# EAGLE design 28ChFNIRS (EAGLE 9.6.2)
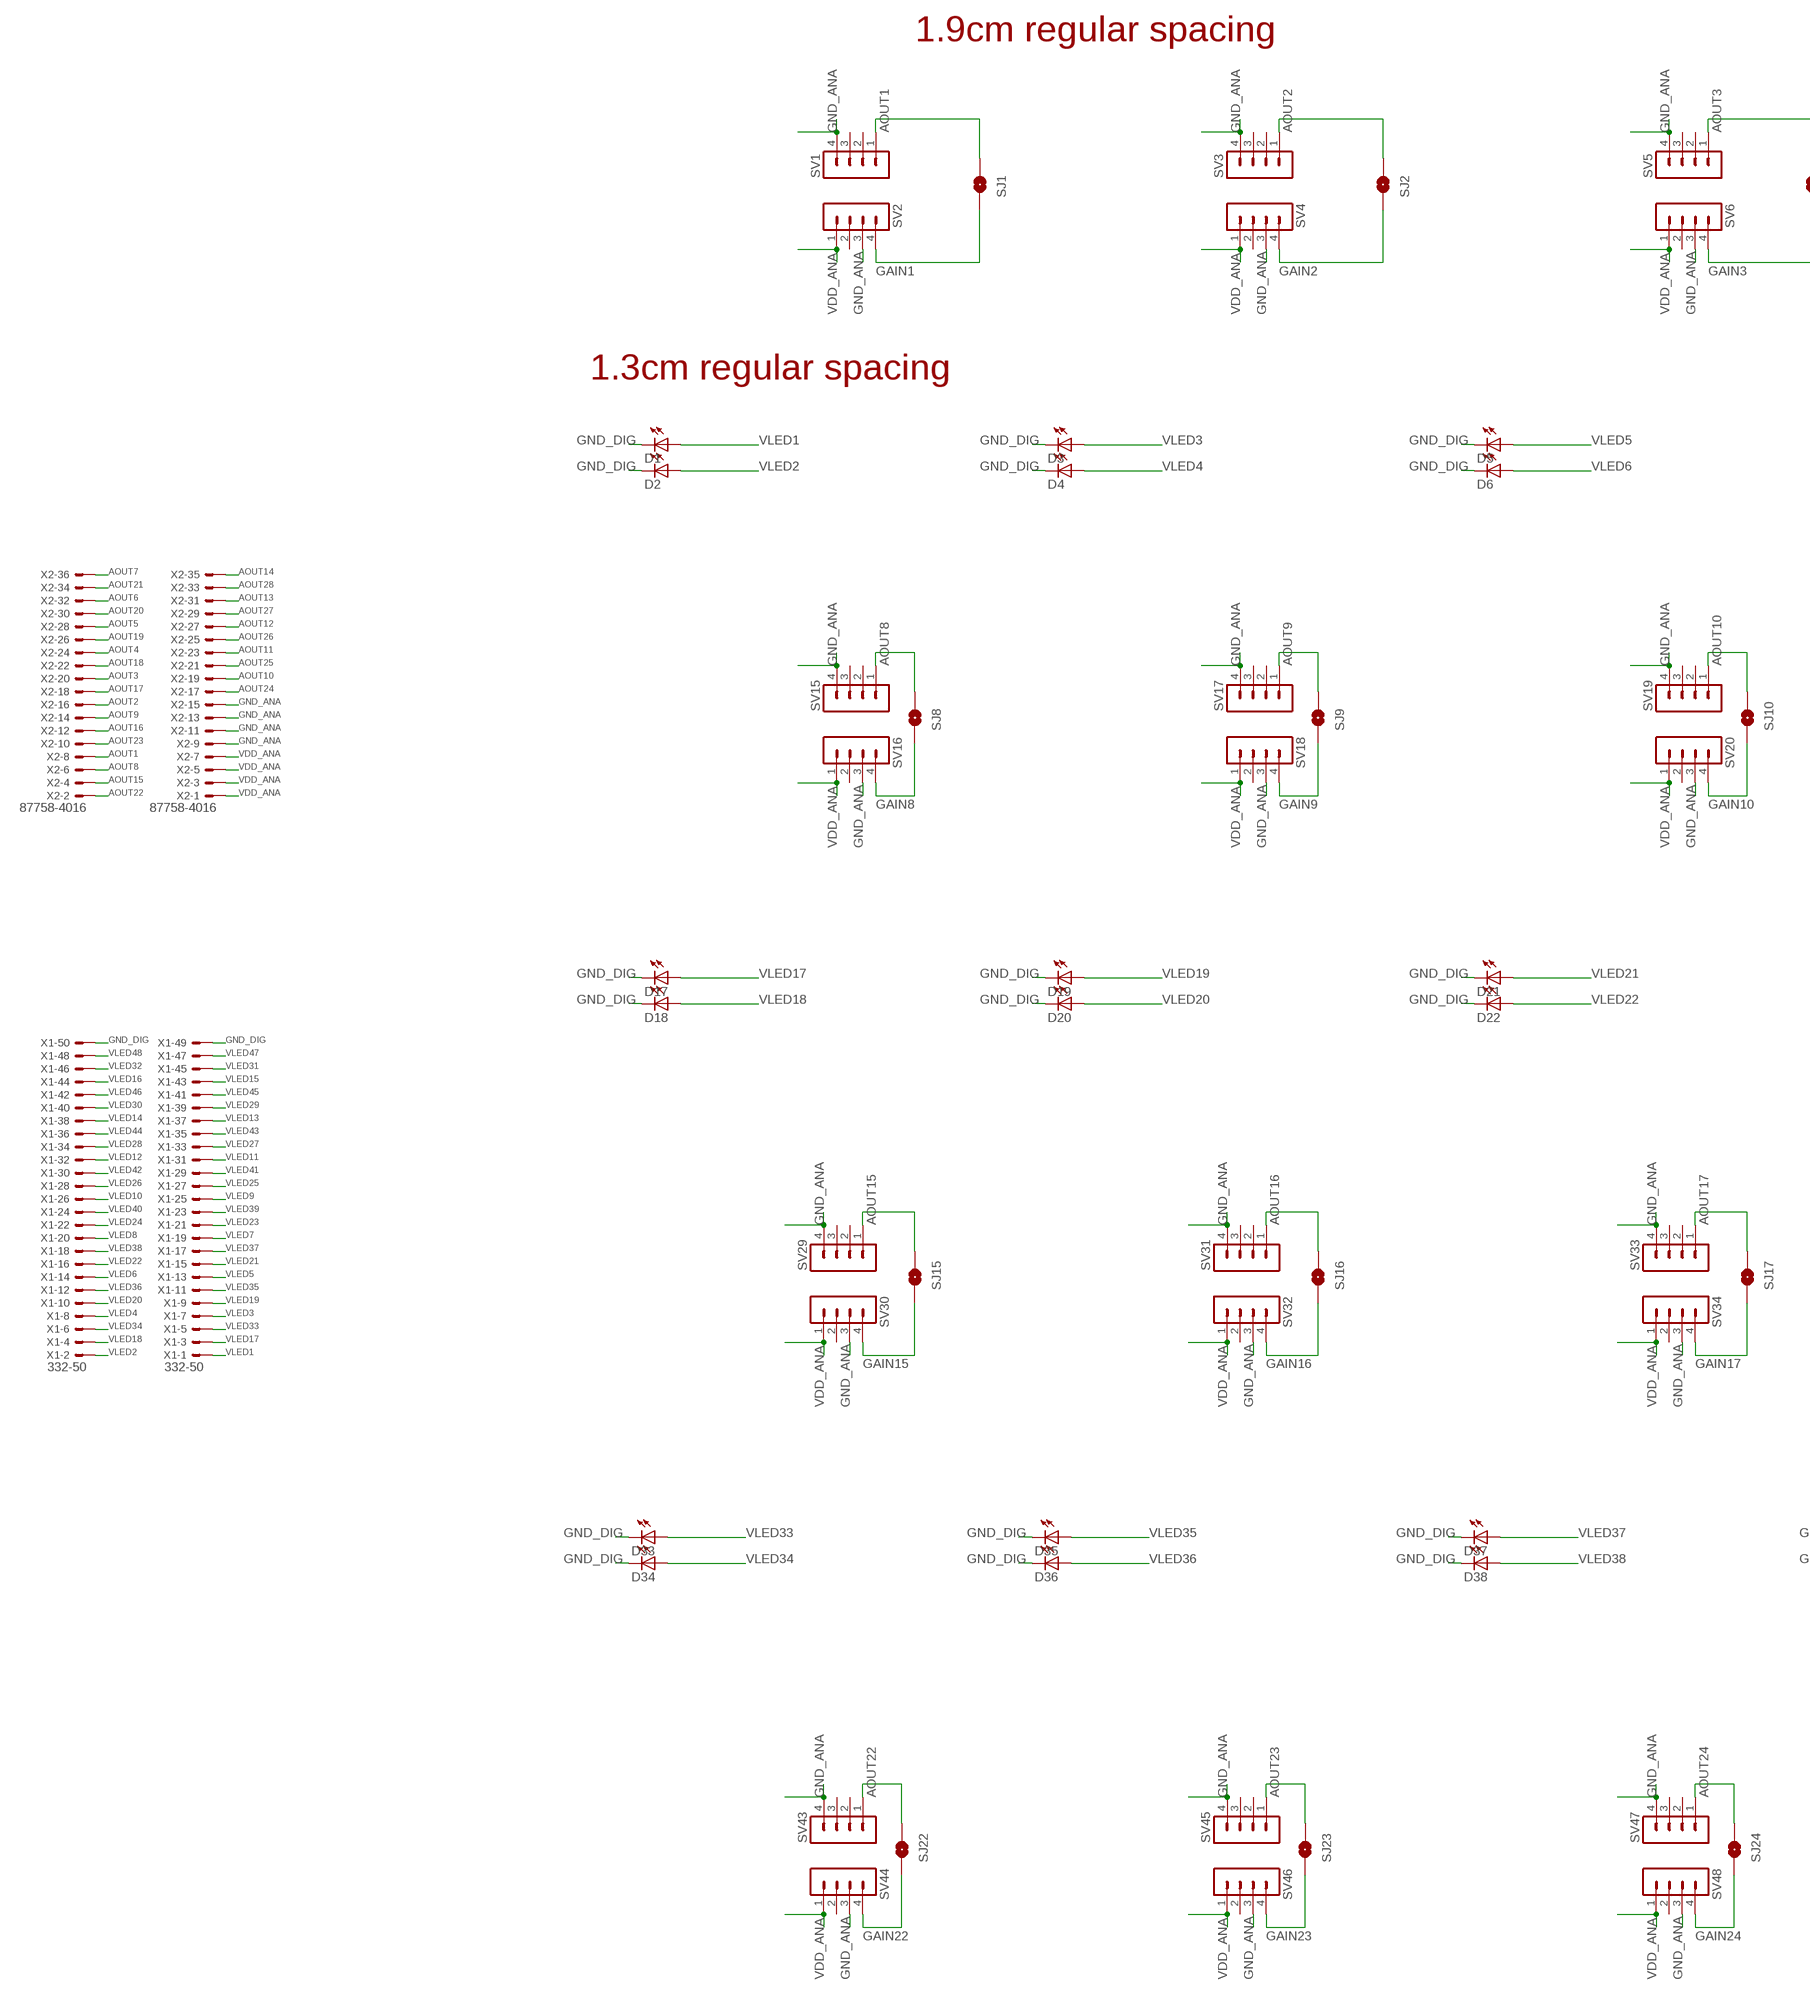
[diagram p0: schematic, sheet 1, part 1 of 2]
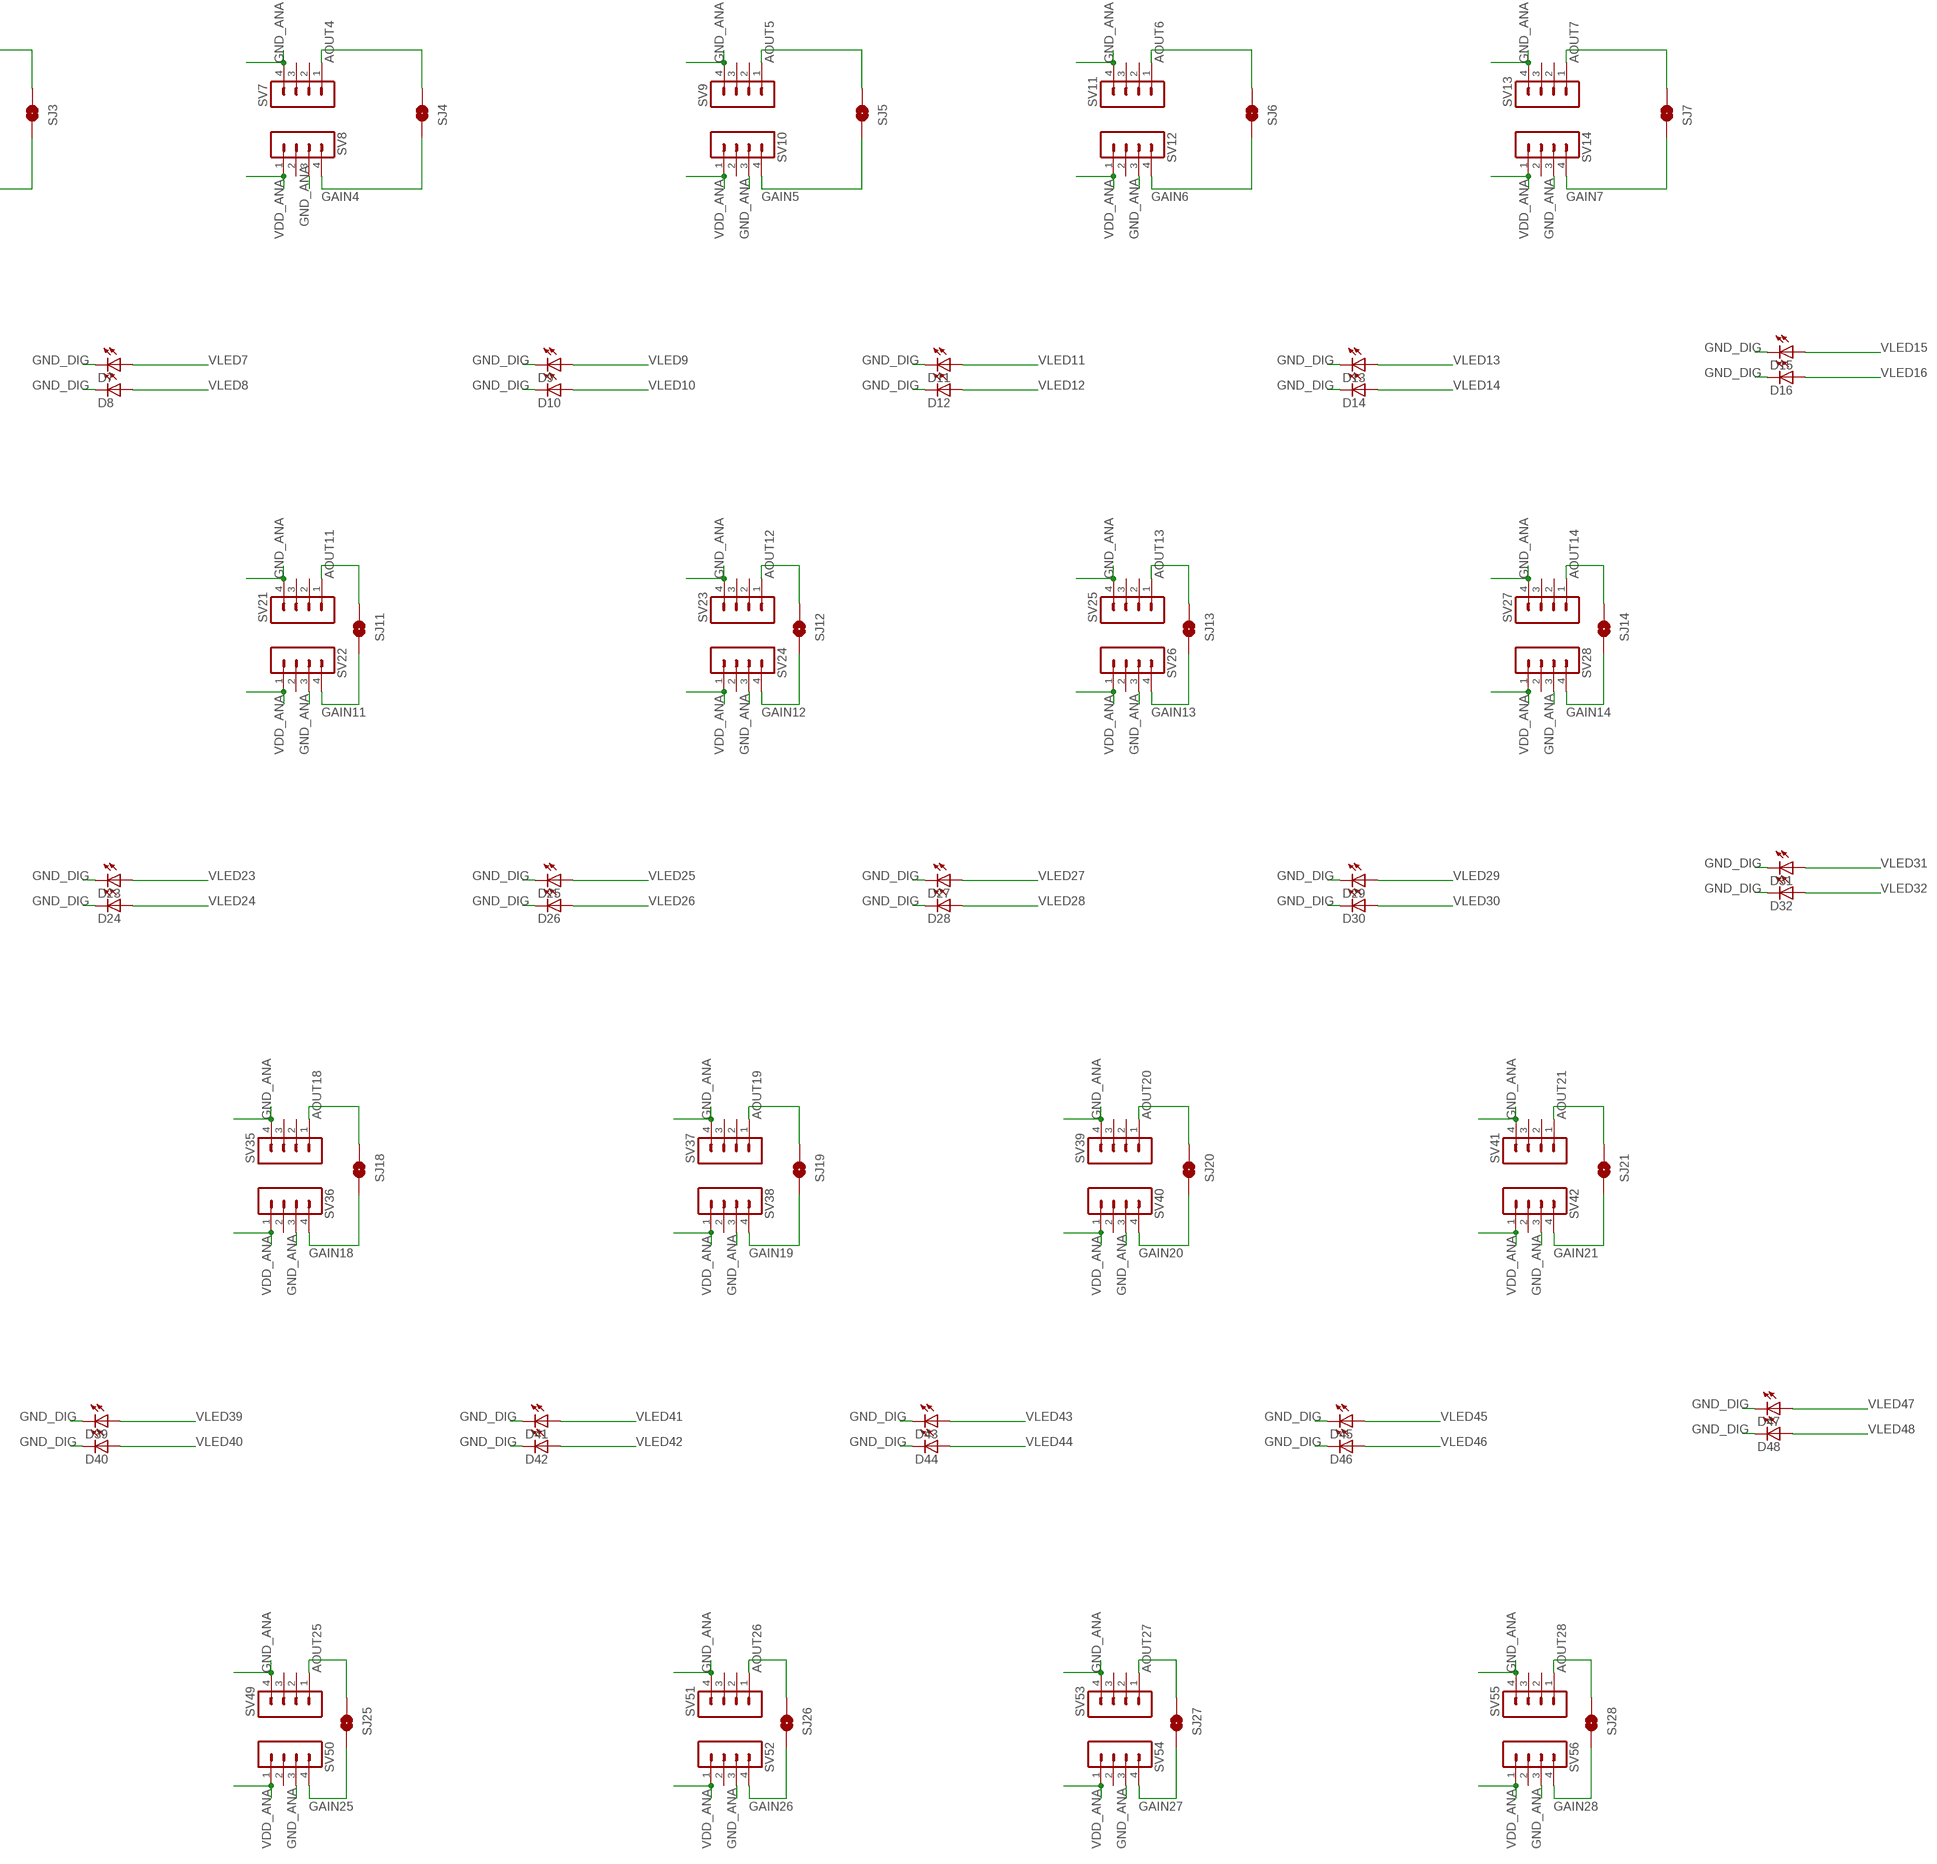
[diagram p1: schematic, sheet 1, part 2 of 2]

## Parts
D1  LED1206  [LED-1206]
D2  LED1206  [LED-1206]
D3  LED1206  [LED-1206]
D4  LED1206  [LED-1206]
D5  LED1206  [LED-1206]
D6  LED1206  [LED-1206]
D7  LED1206  [LED-1206]
D8  LED1206  [LED-1206]
D9  LED1206  [LED-1206]
D10  LED1206  [LED-1206]
D11  LED1206  [LED-1206]
D12  LED1206  [LED-1206]
D13  LED1206  [LED-1206]
D14  LED1206  [LED-1206]
D15  LED1206  [LED-1206]
D16  LED1206  [LED-1206]
D17  LED1206  [LED-1206]
D18  LED1206  [LED-1206]
D19  LED1206  [LED-1206]
D20  LED1206  [LED-1206]
D21  LED1206  [LED-1206]
D22  LED1206  [LED-1206]
D23  LED1206  [LED-1206]
D24  LED1206  [LED-1206]
D25  LED1206  [LED-1206]
D26  LED1206  [LED-1206]
D27  LED1206  [LED-1206]
D28  LED1206  [LED-1206]
D29  LED1206  [LED-1206]
D30  LED1206  [LED-1206]
D31  LED1206  [LED-1206]
D32  LED1206  [LED-1206]
D33  LED1206  [LED-1206]
D34  LED1206  [LED-1206]
D35  LED1206  [LED-1206]
D36  LED1206  [LED-1206]
D37  LED1206  [LED-1206]
D38  LED1206  [LED-1206]
D39  LED1206  [LED-1206]
D40  LED1206  [LED-1206]
D41  LED1206  [LED-1206]
D42  LED1206  [LED-1206]
D43  LED1206  [LED-1206]
D44  LED1206  [LED-1206]
D45  LED1206  [LED-1206]
D46  LED1206  [LED-1206]
D47  LED1206  [LED-1206]
D48  LED1206  [LED-1206]
SJ1  SOLDERJUMPERNC  [SJ_2S_SMALL]
SJ2  SOLDERJUMPERNC  [SJ_2S_SMALL]
SJ3  SOLDERJUMPERNC  [SJ_2S_SMALL]
SJ4  SOLDERJUMPERNC  [SJ_2S_SMALL]
SJ5  SOLDERJUMPERNC  [SJ_2S_SMALL]
SJ6  SOLDERJUMPERNC  [SJ_2S_SMALL]
SJ7  SOLDERJUMPERNC  [SJ_2S_SMALL]
SJ8  SOLDERJUMPERNC  [SJ_2S_SMALL]
SJ9  SOLDERJUMPERNC  [SJ_2S_SMALL]
SJ10  SOLDERJUMPERNC  [SJ_2S_SMALL]
SJ11  SOLDERJUMPERNC  [SJ_2S_SMALL]
SJ12  SOLDERJUMPERNC  [SJ_2S_SMALL]
SJ13  SOLDERJUMPERNC  [SJ_2S_SMALL]
SJ14  SOLDERJUMPERNC  [SJ_2S_SMALL]
SJ15  SOLDERJUMPERNC  [SJ_2S_SMALL]
SJ16  SOLDERJUMPERNC  [SJ_2S_SMALL]
SJ17  SOLDERJUMPERNC  [SJ_2S_SMALL]
SJ18  SOLDERJUMPERNC  [SJ_2S_SMALL]
SJ19  SOLDERJUMPERNC  [SJ_2S_SMALL]
SJ20  SOLDERJUMPERNC  [SJ_2S_SMALL]
SJ21  SOLDERJUMPERNC  [SJ_2S_SMALL]
SJ22  SOLDERJUMPERNC  [SJ_2S_SMALL]
SJ23  SOLDERJUMPERNC  [SJ_2S_SMALL]
SJ24  SOLDERJUMPERNC  [SJ_2S_SMALL]
SJ25  SOLDERJUMPERNC  [SJ_2S_SMALL]
SJ26  SOLDERJUMPERNC  [SJ_2S_SMALL]
SJ27  SOLDERJUMPERNC  [SJ_2S_SMALL]
SJ28  SOLDERJUMPERNC  [SJ_2S_SMALL]
SV1  MA04-1  [MA04-1]
SV2  MA04-1  [MA04-1]
SV3  MA04-1  [MA04-1]
SV4  MA04-1  [MA04-1]
SV5  MA04-1  [MA04-1]
SV6  MA04-1  [MA04-1]
SV7  MA04-1  [MA04-1]
SV8  MA04-1  [MA04-1]
SV9  MA04-1  [MA04-1]
SV10  MA04-1  [MA04-1]
SV11  MA04-1  [MA04-1]
SV12  MA04-1  [MA04-1]
SV13  MA04-1  [MA04-1]
SV14  MA04-1  [MA04-1]
SV15  MA04-1  [MA04-1]
SV16  MA04-1  [MA04-1]
SV17  MA04-1  [MA04-1]
SV18  MA04-1  [MA04-1]
SV19  MA04-1  [MA04-1]
SV20  MA04-1  [MA04-1]
SV21  MA04-1  [MA04-1]
SV22  MA04-1  [MA04-1]
SV23  MA04-1  [MA04-1]
SV24  MA04-1  [MA04-1]
SV25  MA04-1  [MA04-1]
SV26  MA04-1  [MA04-1]
SV27  MA04-1  [MA04-1]
SV28  MA04-1  [MA04-1]
SV29  MA04-1  [MA04-1]
SV30  MA04-1  [MA04-1]
SV31  MA04-1  [MA04-1]
SV32  MA04-1  [MA04-1]
SV33  MA04-1  [MA04-1]
SV34  MA04-1  [MA04-1]
SV35  MA04-1  [MA04-1]
SV36  MA04-1  [MA04-1]
SV37  MA04-1  [MA04-1]
SV38  MA04-1  [MA04-1]
SV39  MA04-1  [MA04-1]
SV40  MA04-1  [MA04-1]
SV41  MA04-1  [MA04-1]
SV42  MA04-1  [MA04-1]
SV43  MA04-1  [MA04-1]
SV44  MA04-1  [MA04-1]
SV45  MA04-1  [MA04-1]
SV46  MA04-1  [MA04-1]
SV47  MA04-1  [MA04-1]
SV48  MA04-1  [MA04-1]
SV49  MA04-1  [MA04-1]
SV50  MA04-1  [MA04-1]
SV51  MA04-1  [MA04-1]
SV52  MA04-1  [MA04-1]
SV53  MA04-1  [MA04-1]
SV54  MA04-1  [MA04-1]
SV55  MA04-1  [MA04-1]
SV56  MA04-1  [MA04-1]
X1  332-50  [332-50]
X2  87758-4016  [87758-4016]

## Nets
AOUT1: SJ1.2 SV1.1 X2.8
AOUT2: SJ2.2 SV3.1 X2.16
AOUT3: SJ3.2 SV5.1 X2.20
AOUT4: SJ4.2 SV7.1 X2.24
AOUT5: SJ5.2 SV9.1 X2.28
AOUT6: SJ6.2 SV11.1 X2.32
AOUT7: SJ7.2 SV13.1 X2.36
AOUT8: SJ8.2 SV15.1 X2.6
AOUT9: SJ9.2 SV17.1 X2.14
AOUT10: SJ10.2 SV19.1 X2.19
AOUT11: SJ11.2 SV21.1 X2.23
AOUT12: SJ12.2 SV23.1 X2.27
AOUT13: SJ13.2 SV25.1 X2.31
AOUT14: SJ14.2 SV27.1 X2.35
AOUT15: SJ15.2 SV29.1 X2.4
AOUT16: SJ16.2 SV31.1 X2.12
AOUT17: SJ17.2 SV33.1 X2.18
AOUT18: SJ18.2 SV35.1 X2.22
AOUT19: SJ19.2 SV37.1 X2.26
AOUT20: SJ20.2 SV39.1 X2.30
AOUT21: SJ21.2 SV41.1 X2.34
AOUT22: SJ22.2 SV43.1 X2.2
AOUT23: SJ23.2 SV45.1 X2.10
AOUT24: SJ24.2 SV47.1 X2.17
AOUT25: SJ25.2 SV49.1 X2.21
AOUT26: SJ26.2 SV51.1 X2.25
AOUT27: SJ27.2 SV53.1 X2.29
AOUT28: SJ28.2 SV55.1 X2.33
GAIN1: SJ1.1 SV2.4
GAIN2: SJ2.1 SV4.4
GAIN3: SJ3.1 SV6.4
GAIN4: SJ4.1 SV8.4
GAIN5: SJ5.1 SV10.4
GAIN6: SJ6.1 SV12.4
GAIN7: SJ7.1 SV14.4
GAIN8: SJ8.1 SV16.4
GAIN9: SJ9.1 SV18.4
GAIN10: SJ10.1 SV20.4
GAIN11: SJ11.1 SV22.4
GAIN12: SJ12.1 SV24.4
GAIN13: SJ13.1 SV26.4
GAIN14: SJ14.1 SV28.4
GAIN15: SJ15.1 SV30.4
GAIN16: SJ16.1 SV32.4
GAIN17: SJ17.1 SV34.4
GAIN18: SJ18.1 SV36.4
GAIN19: SJ19.1 SV38.4
GAIN20: SJ20.1 SV40.4
GAIN21: SJ21.1 SV42.4
GAIN22: SJ22.1 SV44.4
GAIN23: SJ23.1 SV46.4
GAIN24: SJ24.1 SV48.4
GAIN25: SJ25.1 SV50.4
GAIN26: SJ26.1 SV52.4
GAIN27: SJ27.1 SV54.4
GAIN28: SJ28.1 SV56.4
GND_ANA: SV1.4 SV2.3 SV3.4 SV4.3 SV5.4 SV6.3 SV7.4 SV8.3 SV9.4 SV10.3 SV11.4 SV12.3 SV13.4 SV14.3 SV15.4 SV16.3 SV17.4 SV18.3 SV19.4 SV20.3 SV21.4 SV22.3 SV23.4 SV24.3 SV25.4 SV26.3 SV27.4 SV28.3 SV29.4 SV30.3 SV31.4 SV32.3 SV33.4 SV34.3 SV35.4 SV36.3 SV37.4 SV38.3 SV39.4 SV40.3 SV41.4 SV42.3 SV43.4 SV44.3 SV45.4 SV46.3 SV47.4 SV48.3 SV49.4 SV50.3 SV51.4 SV52.3 SV53.4 SV54.3 SV55.4 SV56.3 X2.9 X2.11 X2.13 X2.15
GND_DIG: D1.C D2.C D3.C D4.C D5.C D6.C D7.C D8.C D9.C D10.C D11.C D12.C D13.C D14.C D15.C D16.C D17.C D18.C D19.C D20.C D21.C D22.C D23.C D24.C D25.C D26.C D27.C D28.C D29.C D30.C D31.C D32.C D33.C D34.C D35.C D36.C D37.C D38.C D39.C D40.C D41.C D42.C D43.C D44.C D45.C D46.C D47.C D48.C X1.49 X1.50
VDD_ANA: SV2.1 SV4.1 SV6.1 SV8.1 SV10.1 SV12.1 SV14.1 SV16.1 SV18.1 SV20.1 SV22.1 SV24.1 SV26.1 SV28.1 SV30.1 SV32.1 SV34.1 SV36.1 SV38.1 SV40.1 SV42.1 SV44.1 SV46.1 SV48.1 SV50.1 SV52.1 SV54.1 SV56.1 X2.1 X2.3 X2.5 X2.7
VLED1: D1.A X1.1
VLED2: D2.A X1.2
VLED3: D3.A X1.7
VLED4: D4.A X1.8
VLED5: D5.A X1.13
VLED6: D6.A X1.14
VLED7: D7.A X1.19
VLED8: D8.A X1.20
VLED9: D9.A X1.25
VLED10: D10.A X1.26
VLED11: D11.A X1.31
VLED12: D12.A X1.32
VLED13: D13.A X1.37
VLED14: D14.A X1.38
VLED15: D15.A X1.43
VLED16: D16.A X1.44
VLED17: D17.A X1.3
VLED18: D18.A X1.4
VLED19: D19.A X1.9
VLED20: D20.A X1.10
VLED21: D21.A X1.15
VLED22: D22.A X1.16
VLED23: D23.A X1.21
VLED24: D24.A X1.22
VLED25: D25.A X1.27
VLED26: D26.A X1.28
VLED27: D27.A X1.33
VLED28: D28.A X1.34
VLED29: D29.A X1.39
VLED30: D30.A X1.40
VLED31: D31.A X1.45
VLED32: D32.A X1.46
VLED33: D33.A X1.5
VLED34: D34.A X1.6
VLED35: D35.A X1.11
VLED36: D36.A X1.12
VLED37: D37.A X1.17
VLED38: D38.A X1.18
VLED39: D39.A X1.23
VLED40: D40.A X1.24
VLED41: D41.A X1.29
VLED42: D42.A X1.30
VLED43: D43.A X1.35
VLED44: D44.A X1.36
VLED45: D45.A X1.41
VLED46: D46.A X1.42
VLED47: D47.A X1.47
VLED48: D48.A X1.48
Unconnected: SV1.2 SV1.3 SV2.2 SV3.2 SV3.3 SV4.2 SV5.2 SV5.3 SV6.2 SV7.2 SV7.3 SV8.2 SV9.2 SV9.3 SV10.2 SV11.2 SV11.3 SV12.2 SV13.2 SV13.3 SV14.2 SV15.2 SV15.3 SV16.2 SV17.2 SV17.3 SV18.2 SV19.2 SV19.3 SV20.2 SV21.2 SV21.3 SV22.2 SV23.2 SV23.3 SV24.2 SV25.2 SV25.3 SV26.2 SV27.2 SV27.3 SV28.2 SV29.2 SV29.3 SV30.2 SV31.2 SV31.3 SV32.2 SV33.2 SV33.3 SV34.2 SV35.2 SV35.3 SV36.2 SV37.2 SV37.3 SV38.2 SV39.2 SV39.3 SV40.2 SV41.2 SV41.3 SV42.2 SV43.2 SV43.3 SV44.2 SV45.2 SV45.3 SV46.2 SV47.2 SV47.3 SV48.2 SV49.2 SV49.3 SV50.2 SV51.2 SV51.3 SV52.2 SV53.2 SV53.3 SV54.2 SV55.2 SV55.3 SV56.2 X2.37 X2.38 X2.39 X2.40

## Notes on the sheet
- 1.9cm regular spacing
- 1.3cm regular spacing

## Library data of the parts
D1-D48 = epic:LED: LEDs Standard schematic elements and footprints for 5mm, 3mm, 1206, and 0603 sized LEDs. 5mm - Spark Fun Electronics SKU : COM-00529 (and others)
SJ1-SJ28 = headers:SOLDERJUMPER: Solder Jumper Standard SMD solder jumper. Used to automate production. Two varients : Normally Open and Normally Closed are the same, but have different paste layers. NC will have a large amount of paste and should jumper during reflow.
SV1-SV56 = con-lstb:MA04-1: PIN HEADER; OC_FARNELL: unknown; OC_NEWARK: unknown
X1 = con-garry:332-50: 50 Pin - 2mm Dual Row Source: www.mpe-connector.de / garry_shortform_2012.pdf
X2 = con-molex:87758-4016: 40 Pin - 2mm Dual Row Single Wafer, Vertical T/H HDR Source: http://www.molex.com/pdm_docs/sd/877580616_sd.pdf; MF: MOLEX; MPN: 87758-4016; OC_FARNELL: unknown; OC_NEWARK: 25M5691

## Board
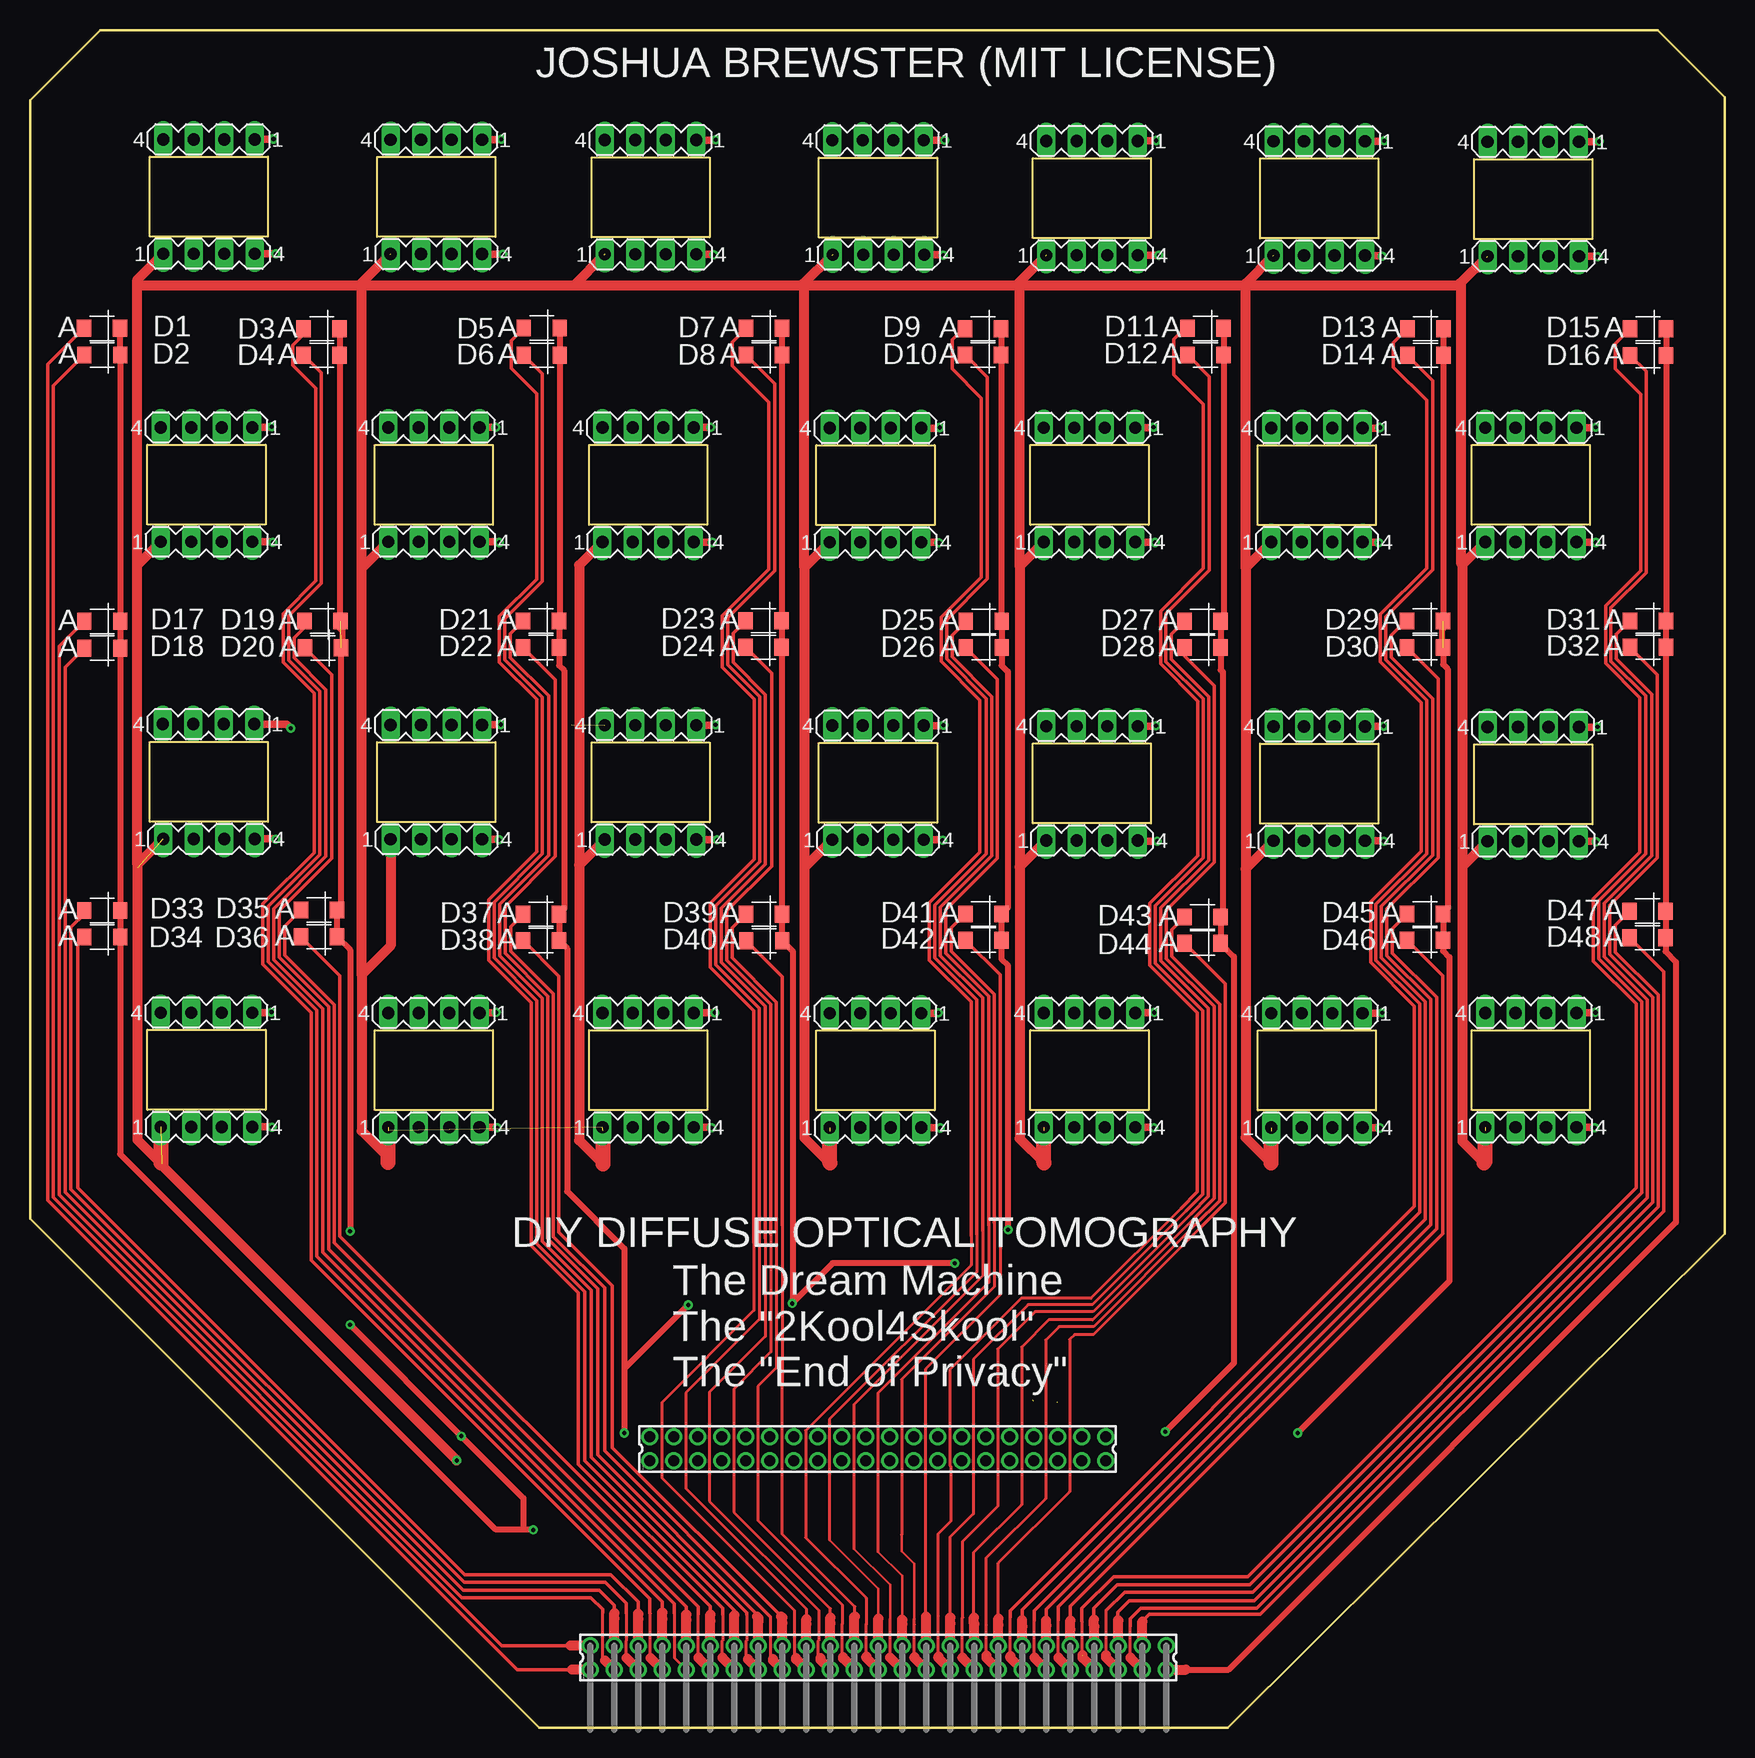
[diagram p2: board, top side]
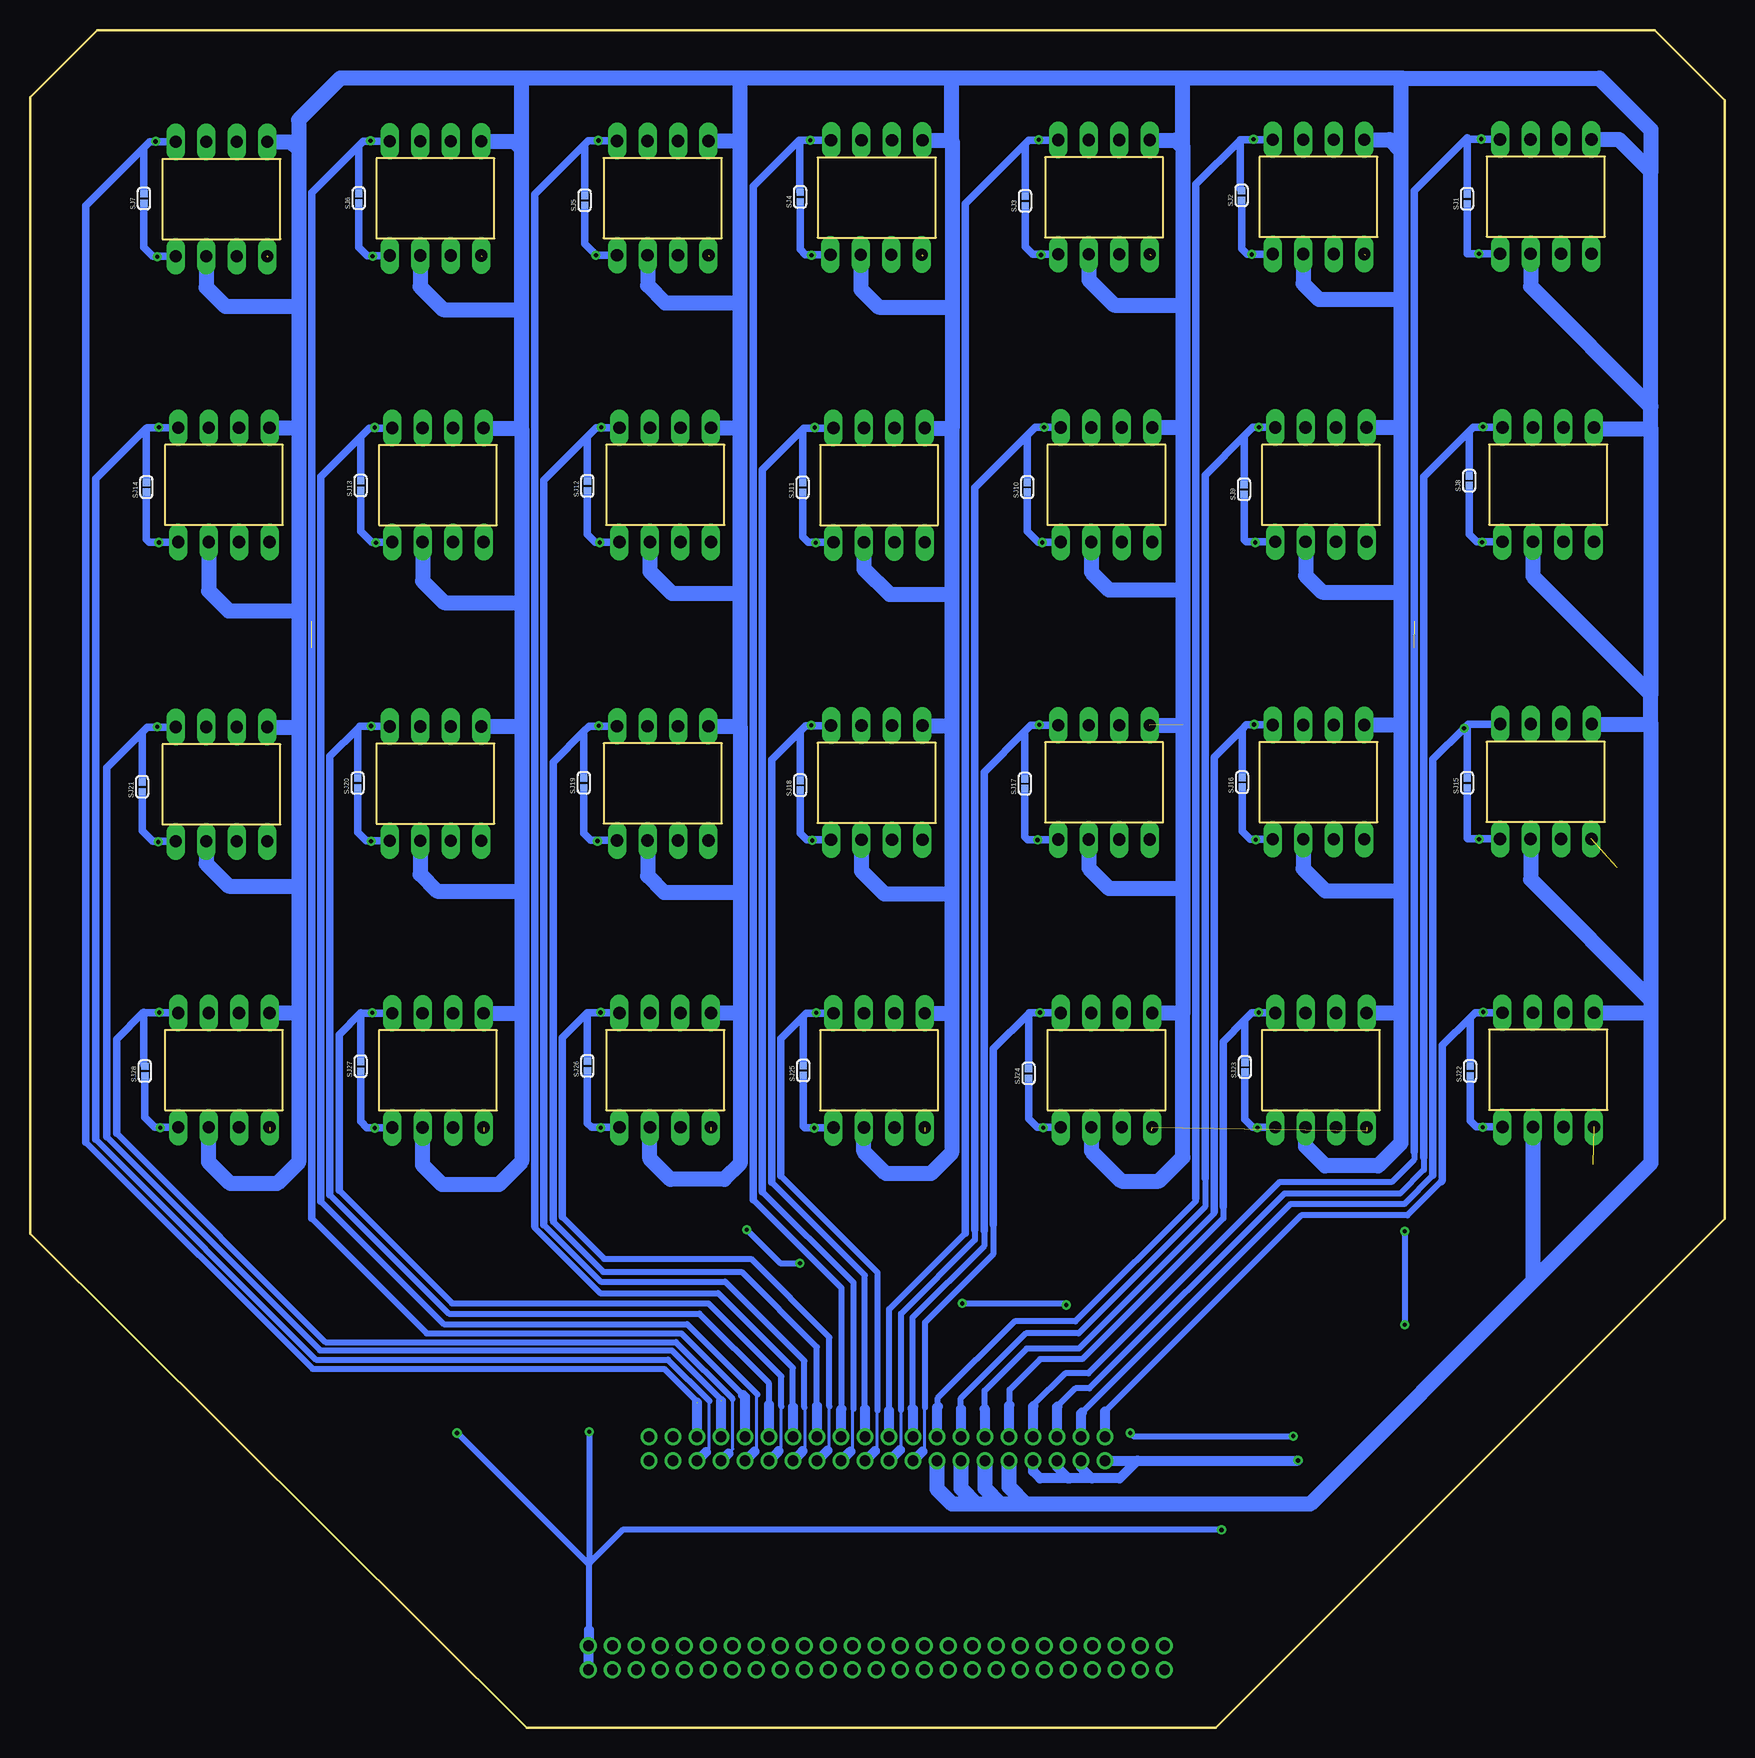
[diagram p3: board, bottom side, seen from below]

Size 141.22 x 141.48 mm. Coordinates in mm from the lower left corner, seen from the top.
Outline: 38.78,124.23 28.94,124.23 28.94,130.9 38.78,130.9 38.78,124.23
Outline: 19.83,124.26 9.99,124.26 9.99,130.92 19.83,130.92 19.83,124.26
Outline: 75.58,124.18 65.74,124.18 65.74,130.85 75.58,130.85 75.58,124.18
Outline: 56.64,124.21 46.79,124.21 46.79,130.87 56.64,130.87 56.64,124.21
Outline: 112.36,124.1 102.52,124.1 102.52,130.77 112.36,130.77 112.36,124.1
Outline: 93.41,124.13 83.57,124.13 83.57,130.8 93.41,130.8 93.41,124.13
Outline: 130.19,124.05 120.35,124.05 120.35,130.72 130.19,130.72 130.19,124.05
Outline: 9.79,106.93 19.63,106.93 19.63,100.27 9.79,100.27 9.79,106.93
Outline: 28.73,106.91 38.58,106.91 38.58,100.24 28.73,100.24 28.73,106.91
Outline: 46.59,106.91 56.43,106.91 56.43,100.24 46.59,100.24 46.59,106.91
Outline: 65.54,106.88 75.38,106.88 75.38,100.22 65.54,100.22 65.54,106.88
Outline: 83.37,106.91 93.21,106.91 93.21,100.24 83.37,100.24 83.37,106.91
Outline: 102.32,106.88 112.16,106.88 112.16,100.22 102.32,100.22 102.32,106.88
Outline: 120.15,106.91 129.99,106.91 129.99,100.24 120.15,100.24 120.15,106.91
Outline: 38.78,75.46 28.94,75.46 28.94,82.13 38.78,82.13 38.78,75.46
Outline: 19.83,75.49 9.99,75.49 9.99,82.16 19.83,82.16 19.83,75.49
Outline: 75.58,75.41 65.74,75.41 65.74,82.08 75.58,82.08 75.58,75.41
Outline: 56.64,75.44 46.79,75.44 46.79,82.11 56.64,82.11 56.64,75.44
Outline: 112.36,75.34 102.52,75.34 102.52,82 112.36,82 112.36,75.34
Outline: 93.41,75.36 83.57,75.36 83.57,82.03 93.41,82.03 93.41,75.36
Outline: 130.19,75.29 120.35,75.29 120.35,81.95 130.19,81.95 130.19,75.29
Outline: 9.79,58.17 19.63,58.17 19.63,51.5 9.79,51.5 9.79,58.17
Outline: 28.73,58.14 38.58,58.14 38.58,51.47 28.73,51.47 28.73,58.14
Outline: 46.59,58.14 56.43,58.14 56.43,51.47 46.59,51.47 46.59,58.14
Outline: 65.54,58.11 75.38,58.11 75.38,51.45 65.54,51.45 65.54,58.11
Outline: 83.37,58.14 93.21,58.14 93.21,51.47 83.37,51.47 83.37,58.14
Outline: 102.32,58.11 112.16,58.11 112.16,51.45 102.32,51.45 102.32,58.11
Outline: 120.15,58.14 129.99,58.14 129.99,51.47 120.15,51.47 120.15,58.14
Outline: 42.42,0 0,42.42 0,135.64 5.84,141.48 135.64,141.48 141.22,135.89 141.22,41.15 99.82,0 42.42,0
Copper layers (1*16): Top 0.035mm / dielectric 1.5mm / Bottom 0.035mm
Design rules "default": minimum track width 6mil, minimum drill 0.35mm, track to track 6mil, track to pad 6mil, pad to pad 6mil, via to via 6mil, smd to smd 6mil, copper to edge 40mil, drill to drill 6mil, minimum pad ring 10mil, minimum via ring 8mil, stop-mask expansion 4mil, vias tented up to drill 0mil, thermal gap 10mil

### Footprints (pad centres in the part's own frame; a part is rotated, then mirrored left to right if it is on the bottom)
LED-1206 = smd 1.2 x 1.4: A -1.5,0; C 1.5,0
SJ_2S_SMALL = smd 0.6 x 0.6: 1 -0.4,0; 2 0.4,0
MA04-1 = drill 1.016 long: 1 -3.81,0; 2 -1.27,0; 3 1.27,0; 4 3.81,0
332-50 = drill 0.9 pad 1.27: 1 -24,-1; 2 -24,1; 3 -22,-1; 4 -22,1; 5 -20,-1; 6 -20,1; 7 -18,-1; 8 -18,1; 9 -16,-1; 10 -16,1; 11 -14,-1; 12 -14,1; 13 -12,-1; 14 -12,1; 15 -10,-1; 16 -10,1; 17 -8,-1; 18 -8,1; 19 -6,-1; 20 -6,1; 21 -4,-1; 22 -4,1; 23 -2,-1; 24 -2,1; 25 0,-1; 26 0,1; 27 2,-1; 28 2,1; 29 4,-1; 30 4,1; 31 6,-1; 32 6,1; 33 8,-1; 34 8,1; 35 10,-1; 36 10,1; 37 12,-1; 38 12,1; 39 14,-1; 40 14,1; 41 16,-1; 42 16,1; 43 18,-1; 44 18,1; 45 20,-1; 46 20,1; 47 22,-1; 48 22,1; 49 24,-1; 50 24,1
87758-4016 = drill 0.9 pad 1.27: 1 -19,-1; 2 -19,1; 3 -17,-1; 4 -17,1; 5 -15,-1; 6 -15,1; 7 -13,-1; 8 -13,1; 9 -11,-1; 10 -11,1; 11 -9,-1; 12 -9,1; 13 -7,-1; 14 -7,1; 15 -5,-1; 16 -5,1; 17 -3,-1; 18 -3,1; 19 -1,-1; 20 -1,1; 21 1,-1; 22 1,1; 23 3,-1; 24 3,1; 25 5,-1; 26 5,1; 27 7,-1; 28 7,1; 29 9,-1; 30 9,1; 31 11,-1; 32 11,1; 33 13,-1; 34 13,1; 35 15,-1; 36 15,1; 37 17,-1; 38 17,1; 39 19,-1; 40 19,1

### Placement (x,y rotation side)
D1  5.99,116.61 0 top
D2  6.02,114.4 0 top
D3  24.31,116.59 0 top
D4  24.31,114.38 0 top
D5  42.65,116.64 0 top
D6  42.65,114.38 0 top
D7  61.16,116.61 0 top
D8  61.16,114.4 0 top
D9  79.43,116.59 0 top
D10  79.43,114.4 0 top
D11  97.97,116.61 0 top
D12  97.97,114.4 0 top
D13  116.28,116.59 0 top
D14  116.28,114.38 0 top
D15  134.85,116.59 0 top
D16  134.85,114.35 0 top
D17  6.02,92.2 0 top
D18  6.02,89.97 0 top
D19  24.36,92.23 0 top
D20  24.41,89.99 0 top
D21  42.6,92.23 0 top
D22  42.6,90.02 0 top
D23  61.14,92.25 0 top
D24  61.14,90.04 0 top
D25  79.48,92.2 0 top
D26  79.48,90.02 0 top
D27  97.71,92.2 0 top
D28  97.71,90.02 0 top
D29  116.26,92.23 0 top
D30  116.26,90.02 0 top
D31  134.82,92.23 0 top
D32  134.82,90.04 0 top
D33  6.02,68.1 0 top
D34  6.02,65.89 0 top
D35  24.08,68.15 0 top
D36  24.08,65.91 0 top
D37  42.6,67.79 0 top
D38  42.6,65.61 0 top
D39  61.16,67.79 0 top
D40  61.19,65.58 0 top
D41  79.45,67.82 0 top
D42  79.45,65.63 0 top
D43  97.71,67.56 0 top
D44  97.71,65.38 0 top
D45  116.26,67.82 0 top
D46  116.26,65.63 0 top
D47  134.8,68.05 0 top
D48  134.8,65.84 0 top
SJ1  21.46,127.41 90 bottom
SJ2  40.26,127.69 90 bottom
SJ3  58.29,127.23 90 bottom
SJ4  77.04,127.56 90 bottom
SJ5  95,127.28 90 bottom
SJ6  113.82,127.46 90 bottom
SJ7  131.72,127.43 90 bottom
SJ8  21.29,103.91 90 bottom
SJ9  40.06,103.2 90 bottom
SJ10  58.12,103.38 90 bottom
SJ11  76.83,103.35 90 bottom
SJ12  94.77,103.48 90 bottom
SJ13  113.66,103.5 90 bottom
SJ14  131.52,103.38 90 bottom
SJ15  21.46,78.74 90 bottom
SJ16  40.21,78.79 90 bottom
SJ17  58.32,78.66 90 bottom
SJ18  77.04,78.54 90 bottom
SJ19  95.07,78.74 90 bottom
SJ20  113.92,78.71 90 bottom
SJ21  131.88,78.41 90 bottom
SJ22  21.21,54.71 90 bottom
SJ23  39.98,55.04 90 bottom
SJ24  58.01,54.53 90 bottom
SJ25  76.78,54.76 90 bottom
SJ26  94.77,55.14 90 bottom
SJ27  113.66,55.12 90 bottom
SJ28  131.65,54.71 90 bottom
SV1  14.91,132.36 180 top
SV2  14.91,122.83 0 top
SV3  33.86,132.33 180 top
SV4  33.86,122.81 0 top
SV5  51.71,132.31 180 top
SV6  51.71,122.78 0 top
SV7  70.66,132.28 180 top
SV8  70.71,122.76 0 top
SV9  88.49,132.23 180 top
SV10  88.49,122.71 0 top
SV11  107.44,132.21 180 top
SV12  107.44,122.68 0 top
SV13  125.27,132.16 180 top
SV14  125.27,122.63 0 top
SV15  14.71,108.36 180 top
SV16  14.71,98.83 0 top
SV17  33.66,108.36 180 top
SV18  33.66,98.83 0 top
SV19  51.51,108.36 180 top
SV20  51.51,98.81 0 top
SV21  70.46,108.31 180 top
SV22  70.46,98.78 0 top
SV23  88.29,108.33 180 top
SV24  88.29,98.81 0 top
SV25  107.24,108.31 180 top
SV26  107.24,98.81 0 top
SV27  125.07,108.33 180 top
SV28  125.07,98.81 0 top
SV29  14.88,83.64 180 top
SV30  14.91,74.07 0 top
SV31  33.86,83.57 180 top
SV32  33.86,74.04 0 top
SV33  51.71,83.54 180 top
SV34  51.71,74.02 0 top
SV35  70.66,83.52 180 top
SV36  70.66,73.99 0 top
SV37  88.49,83.46 180 top
SV38  88.49,73.94 0 top
SV39  107.44,83.44 180 top
SV40  107.44,73.91 0 top
SV41  125.27,83.39 180 top
SV42  125.27,73.86 0 top
SV43  14.71,59.59 180 top
SV44  14.71,50.06 0 top
SV45  33.66,59.56 180 top
SV46  33.66,50.04 0 top
SV47  51.51,59.56 180 top
SV48  51.51,50.04 0 top
SV49  70.46,59.54 180 top
SV50  70.46,50.01 0 top
SV51  88.29,59.56 180 top
SV52  88.29,50.04 0 top
SV53  107.24,59.54 180 top
SV54  107.24,50.01 0 top
SV55  125.07,59.56 180 top
SV56  125.07,50.04 0 top
X1  70.69,5.84 0 top
X2  70.64,23.24 0 top

### Tracks (layer width: path | path; a pad name or v marks a point on that pad's centre or on a via)
AOUT1  (via drill 0.35)
  Top 0.61: SV1.1 20.29,132.36 v20.29,132.39
  Bottom 0.508: 25.88,48.01 25.88,47.35 27.76,45.47 37.11,45.47 53.03,29.54 54.97,29.54 57.61,26.9 57.61,26.8
  Bottom 0.61: SJ1.2 21.46,132.49 21.59,132.36 | SV1.1 21.59,132.36 | 21.59,132.36 25.88,128.07 25.88,48.01
  Bottom 0.813: X2.8 57.64,26.77 57.61,26.8
AOUT2  (via drill 0.35)
  Top 0.61: SV3.1 39.27,132.33 v39.27,132.37
  Bottom 0.508: 44.07,44.12 44.07,43.89 54.1,33.86 59.18,33.86 65.56,27.48 65.56,26.77
  Bottom 0.61: 40.39,132.31 40.39,128.21 SJ2.2 | 40.39,132.31 40.36,132.33 SV3.1 | 40.39,132.31 44.07,128.63 44.07,44.12
  Bottom 0.813: X2.16 65.64,26.69 65.56,26.77
AOUT3  (via drill 0.35)
  Top 0.61: SV5.1 57.15,132.31 v57.15,132.34
  Bottom 0.508: 63.3,41.22 63.3,41.2 69.62,34.87 69.62,26.44
  Bottom 0.61: SJ3.2 58.29,132 | SV5.1 57.99,132.31 58.29,132 | 58.29,132 63.3,127 63.3,41.22
  Bottom 0.813: X2.20 69.64,26.42 69.62,26.44
AOUT4  (via drill 0.35)
  Top 0.61: SV7.1 76.21,132.28 v76.21,132.3
  Bottom 0.508: 73.58,26.54 73.58,36.63 80.95,43.99
  Bottom 0.61: SJ4.2 77.09,128.01 77.09,132.31 77.11,132.28 | 77.11,132.28 77.14,132.28 78.16,131.27 78.16,131.24 80.95,128.45 80.95,43.99 | 77.11,132.28 SV7.1
  Bottom 0.813: X2.24 73.64,26.49 73.58,26.54
AOUT5  (via drill 0.35)
  Top 0.61: SV9.1 93.85,132.23 v93.85,132.27
  Bottom 0.508: 99.16,41.81 99.16,41.67 93.72,36.22 83.87,36.22 77.65,30 77.65,26.75
  Bottom 0.61: SJ5.2 95,131.95 | SV9.1 94.72,132.23 95,131.95 | 95,131.95 99.16,127.79 99.16,41.81
  Bottom 0.813: X2.28 77.64,26.74 77.65,26.75
AOUT6  (via drill 0.35)
  Top 0.61: SV11.1 112.85,132.21 v112.85,132.24
  Bottom 0.508: 117.75,42.44 108.18,32.87 86.94,32.87 81.79,27.71
  Bottom 0.61: SJ6.2 113.82,131.85 | SV11.1 113.46,132.21 113.82,131.85 | 113.82,131.85 117.75,127.91 117.75,42.44
  Bottom 0.813: X2.32 81.64,27.56 81.79,27.71
AOUT7  (via drill 0.35)  (1 unrouted)
  Top 0.61: SV13.1 130.76,132.16 v130.76,132.19
  Bottom 0.508: 136.58,48.79 117.68,29.9 88.37,29.9 85.6,27.13
  Bottom 0.61: SJ7.2 131.72,131.67 | 131.72,131.67 131.24,132.16 SV13.1 | 131.72,131.67 136.58,126.82 136.58,48.79
  Bottom 0.813: X2.36 85.64,27.09 85.63,27.1
AOUT8  (via drill 0.35)
  Top 0.61: SV15.1 20.14,108.36 v20.14,108.4
  Bottom 0.508: 25.07,47.55 25.07,46.48 27.05,44.5 36.7,44.5 52.93,28.27 54.1,28.27 55.6,26.77
  Bottom 0.61: SJ8.2 21.29,108.03 | SV15.1 20.96,108.36 21.29,108.03 | 21.29,108.03 25.07,104.24 25.07,47.55
  Bottom 0.813: X2.6 55.64,26.73 55.6,26.77
AOUT9  (via drill 0.35)
  Top 0.61: SV17.1 38.81,108.36 v38.81,108.38
  Bottom 0.508: 43.31,45.8 43.31,43.41 53.85,32.87 58.24,32.87 63.65,27.46 63.65,26.57
  Bottom 0.61: SJ9.2 40.06,107.64 | 40.06,107.64 39.34,108.36 SV17.1 | 40.06,107.64 43.31,104.39 43.31,45.8
  Bottom 0.813: X2.14 63.64,26.55 63.65,26.57
AOUT10  (via drill 0.35)
  Top 0.61: SV19.1 56.72,108.36 v56.72,108.38
  Bottom 0.254: 68.72,23.16 68.63,23.25 68.63,26.49
  Bottom 0.508: 62.48,41.81 62.48,40.66 68.63,34.52 68.63,26.49
  Bottom 0.61: SJ10.2 58.11,107.7 | 58.11,107.7 57.45,108.36 SV19.1 | 58.11,107.7 62.48,103.33 62.48,41.81 62.48,41.48
  Bottom 0.813: X2.19 68.72,23.16
AOUT11  (via drill 0.35)
  Top 0.61: SV21.1 75.82,108.31 v75.82,108.35
  Bottom 0.254: 72.86,23.02 72.64,23.23 72.64,26.52 72.59,26.57
  Bottom 0.508: 72.59,26.57 72.59,37.08 80.19,44.68
  Bottom 0.61: SJ11.2 76.83,108.2 | SV21.1 76.73,108.31 76.83,108.2 | 76.83,108.2 80.19,104.85 80.19,44.68
  Bottom 0.813: X2.23 72.86,23.02
AOUT12  (via drill 0.35)
  Top 0.61: SV23.1 93.62,108.33 v93.62,108.38
  Bottom 0.254: 76.84,23.04 76.63,23.25 76.63,26.64 76.68,26.69
  Bottom 0.508: 98.4,41.91 93.67,37.19 83.29,37.19 76.68,30.58 76.68,26.69
  Bottom 0.61: SJ12.2 94.77,107.59 | 94.77,107.59 94.03,108.33 SV23.1 | 94.77,107.59 98.4,103.96 98.4,41.91
  Bottom 0.813: X2.27 76.84,23.04
AOUT13  (via drill 0.35)
  Top 0.61: SV25.1 112.5,108.31 v112.5,108.35
  Bottom 0.254: 80.84,23.03 80.64,23.23 80.64,27.71 80.59,27.76
  Bottom 0.508: 116.99,43.89 106.73,33.63 86.46,33.63 80.59,27.76
  Bottom 0.61: SJ13.2 113.66,107.59 | 113.66,107.59 112.95,108.31 SV25.1 | 113.66,107.59 116.99,104.27 116.99,43.89
  Bottom 0.813: X2.31 80.84,23.03
AOUT14  (via drill 0.35)
  Top 0.61: SV27.1 130.48,108.33 v130.48,108.38
  Bottom 0.254: 84.89,22.99 84.63,23.25 84.63,27.2 84.61,27.23
  Bottom 0.508: 135.74,49.02 117.4,30.68 88.06,30.68 84.61,27.23
  Bottom 0.61: SJ14.2 131.52,108.28 | SV27.1 131.47,108.33 131.52,108.28 | 131.52,108.28 135.74,104.06 135.74,49.02
  Bottom 0.813: X2.35 84.89,22.99
AOUT15  (via drill 0.35)
  Top 0.61: SV29.1 18.72,83.62 21.39,83.62 v21.72,83.29
  Bottom 0.508: 24.31,46.02 26.69,43.64 36.19,43.64 53.57,26.26
  Bottom 0.61: SJ15.2 21.46,83.54 | 21.46,83.54 21.36,83.64 SV29.1 | 21.46,83.54 v21.72,83.29 24.31,80.7 24.31,46.02
  Bottom 0.813: X2.4 53.64,26.19 53.57,26.26
AOUT16  (via drill 0.35)
  Top 0.61: SV31.1 39.22,83.57 v39.22,83.6
  Bottom 0.508: 42.55,43 42.55,42.88 53.82,31.6 58.17,31.6 61.67,28.09 61.67,26.57
  Bottom 0.61: 40.21,83.21 39.85,83.57 SV31.1 | SJ16.2 40.21,83.21 | 40.21,83.21 42.55,80.87 42.55,43
  Bottom 0.813: X2.12 61.64,26.53 61.67,26.57
AOUT17  (via drill 0.35)
  Top 0.61: SV33.1 57.12,83.54 v57.12,83.58
  Bottom 0.508: 61.72,41.4 61.72,40.13 67.67,34.19 67.67,26.59
  Bottom 0.61: SJ17.2 58.32,83.03 | SV33.1 57.81,83.54 58.32,83.03 | 58.32,83.03 61.72,79.63 61.72,41.4
  Bottom 0.813: X2.18 67.64,26.57 67.67,26.59
AOUT18  (via drill 0.35)
  Top 0.61: SV35.1 76.12,83.52 v76.12,83.55
  Bottom 0.508: 71.65,26.54 71.65,37.69 79.43,45.47
  Bottom 0.61: SJ18.2 77.04,83.06 | SV35.1 76.58,83.52 77.04,83.06 | 77.04,83.06 79.43,80.67 79.43,45.47
  Bottom 0.813: X2.22 71.64,26.53 71.65,26.54
AOUT19  (via drill 0.35)
  Top 0.61: SV37.1 93.83,83.46 v93.83,83.5
  Bottom 0.508: 97.64,42.34 97.64,42.16 93.47,38 81.91,38 75.64,31.72 75.64,26.82
  Bottom 0.61: SJ19.2 95.07,83.03 | 95.07,83.03 94.64,83.46 SV37.1 | 95.07,83.03 97.64,80.47 97.64,42.34
  Bottom 0.813: X2.26 75.64,26.82
AOUT20  (via drill 0.35)
  Top 0.61: SV39.1 112.8,83.44 v112.8,83.47
  Bottom 0.508: 116.23,44.42 106.32,34.52 85.45,34.52 79.63,28.7 79.63,26.92
  Bottom 0.61: SJ20.2 113.92,83.26 | 113.92,83.26 113.74,83.44 SV39.1 | 113.92,83.26 116.23,80.95 116.23,44.42
  Bottom 0.813: X2.30 79.64,26.92 79.63,26.92
AOUT21  (via drill 0.35)  (1 unrouted)
  Top 0.61: SV41.1 130.63,83.39 v130.63,83.42
  Bottom 0.508: 134.85,49.25 117.04,31.44 87.73,31.44 83.56,27.28
  Bottom 0.61: SJ21.2 131.88,82.96 | SV41.1 131.45,83.39 131.88,82.96 | 131.88,82.96 134.85,79.98 134.85,49.25
  Bottom 0.813: X2.34 83.64,27.2 83.63,27.21
AOUT22  (via drill 0.35)
  Top 0.61: SV43.1 20.12,59.59 v20.12,59.64
  Bottom 0.508: 23.52,45.61 23.53,45.61 26.44,42.7 35.31,42.7 51.64,26.36
  Bottom 0.61: SJ22.2 21.21,59.18 | 21.21,59.18 20.8,59.59 SV43.1 | 21.21,59.18 23.52,56.87 23.52,45.61 23.62,45.51
  Bottom 0.813: X2.2 51.64,26.36
AOUT23  (via drill 0.35)
  Top 0.61: SV45.1 38.84,59.56 v38.84,59.61
  Bottom 0.508: 41.78,43.76 41.78,42.44 53.52,30.71 57.05,30.71 59.59,28.17 59.59,26.9
  Bottom 0.61: SJ23.2 39.98,58.98 | 39.98,58.98 39.39,59.56 SV45.1 | 39.98,58.98 41.78,57.17 41.78,43.76 41.78,43.43
  Bottom 0.813: X2.10 59.64,26.85 59.59,26.9
AOUT24  (via drill 0.35)
  Top 0.61: SV47.1 57.06,59.56 v57.06,59.6
  Bottom 0.254: 66.85,23.03 66.65,23.23 66.65,26.64 66.62,26.67
  Bottom 0.508: 60.96,41.91 60.96,39.45 66.62,33.78 66.62,26.67
  Bottom 0.61: SJ24.2 58.01,59.51 | 58.01,59.51 57.96,59.56 SV47.1 | 58.01,59.51 60.96,56.57 60.96,41.91
  Bottom 0.813: X2.17 66.85,23.03
AOUT25  (via drill 0.35)
  Top 0.61: SV49.1 75.69,59.54 v75.69,59.59
  Bottom 0.254: 70.83,23.05 70.64,23.24 70.64,26.39 70.59,26.44
  Bottom 0.508: 70.59,26.44 70.59,37.92 78.66,46
  Bottom 0.61: SJ25.2 76.78,59.28 | SV49.1 76.53,59.54 76.78,59.28 | 76.78,59.28 78.66,57.4 78.66,46
  Bottom 0.813: X2.21 70.83,23.05
AOUT26  (via drill 0.35)
  Top 0.61: SV51.1 93.67,59.56 v93.67,59.61
  Bottom 0.254: 74.78,23.09 74.62,23.25 74.62,26.75 74.6,26.77
  Bottom 0.508: 96.88,42.57 93.37,39.06 81.13,39.06 74.6,32.54 74.6,26.77
  Bottom 0.61: SJ26.2 94.77,59.59 94.79,59.56 | 94.79,59.56 SV51.1 | 94.79,59.56 96.88,57.48 96.88,42.57
  Bottom 0.813: X2.25 74.78,23.09
AOUT27  (via drill 0.35)
  Top 0.61: SV53.1 112.7,59.54 v112.7,59.59
  Bottom 0.254: 78.83,23.05 78.64,23.24 78.64,26.75 78.61,26.77
  Bottom 0.508: 115.47,44.78 106.05,35.36 84.68,35.36 78.61,29.29 78.61,26.77
  Bottom 0.61: SJ27.2 113.66,59.56 113.69,59.54 | 113.69,59.54 SV53.1 | 113.69,59.54 115.47,57.76 115.47,44.78
  Bottom 0.813: X2.29 78.83,23.05
AOUT28  (via drill 0.35)
  Top 0.61: SV55.1 130.45,59.56 v130.45,59.61
  Bottom 0.254: 83.01,22.87 82.65,23.23 82.65,27.38 82.68,27.41
  Bottom 0.508: 134.01,49.53 116.61,32.13 87.4,32.13 82.68,27.41
  Bottom 0.61: SJ28.2 131.75,55.21 131.75,59.64 131.83,59.56 | 131.83,59.56 SV55.1 | 131.83,59.56 134.01,57.38 134.01,49.53
  Bottom 0.813: X2.33 83.01,22.87
GAIN1  (via drill 0.35)
  Top 0.61: SV2.4 v20.48,122.83
  Bottom 0.61: SV2.4 21.46,122.83 SJ1.1
GAIN2  (via drill 0.35)
  Top 0.61: SV4.4 39.4,122.81 v39.4,122.78
  Bottom 0.61: SV4.4 39.8,122.81 40.26,123.27 SJ2.1
GAIN3  (via drill 0.35)
  Top 0.61: SV6.4 56.97,122.78 v56.97,122.74
  Bottom 0.61: SV6.4 57.66,122.78 58.29,123.42 SJ3.1
GAIN4  (via drill 0.35)
  Top 0.61: SV8.4 76.1,122.76 v76.1,122.71
  Bottom 0.61: SV8.4 76.61,122.76 77.04,123.19 SJ4.1
GAIN5  (via drill 0.35)
  Top 0.61: SV10.4 v94.06,122.71 v94.06,122.7
  Bottom 0.61: SV10.4 94.06,122.71 95,123.65 SJ5.1
GAIN6  (via drill 0.35)
  Top 0.61: SV12.4 112.67,122.68 v112.67,122.63
  Bottom 0.61: SV12.4 113.11,122.68 113.82,123.39 SJ6.1
GAIN7  (via drill 0.35)
  Top 0.61: SV14.4 130.63,122.63 v130.63,122.58
  Bottom 0.61: SV14.4 130.99,122.63 131.72,123.37 SJ7.1
GAIN8  (via drill 0.35)
  Top 0.61: SV16.4 20.22,98.83 v20.22,98.8
  Bottom 0.61: SV16.4 20.65,98.83 21.29,99.47 SJ8.1
GAIN9  (via drill 0.35)
  Top 0.61: SV18.4 39.12,98.83 v39.12,98.77
  Bottom 0.61: SV18.4 39.88,98.83 40.06,99.01 SJ9.1
GAIN10  (via drill 0.35)
  Top 0.61: SV20.4 56.87,98.81 v56.87,98.77
  Bottom 0.61: SV20.4 57.2,98.81 58.11,99.72 SJ10.1
GAIN11  (via drill 0.35)
  Top 0.61: SV22.4 75.74,98.78 v75.74,98.75
  Bottom 0.61: SV22.4 76.35,98.78 76.83,99.26 SJ11.1
GAIN12  (via drill 0.35)
  Top 0.61: SV24.4 93.75,98.81 v93.75,98.77
  Bottom 0.61: SV24.4 94.11,98.81 94.77,99.47 SJ12.1
GAIN13  (via drill 0.35)
  Top 0.61: SV26.4 112.39,98.81 v112.39,98.75
  Bottom 0.61: SV26.4 112.75,98.81 113.66,99.72 SJ13.1
GAIN14  (via drill 0.35)
  Top 0.61: SV28.4 130.48,98.81 v130.48,98.77
  Bottom 0.61: SV28.4 131.27,98.81 131.52,99.06 SJ14.1
GAIN15  (via drill 0.35)
  Top 0.61: SV30.4 20.47,74.07 v20.47,74.05
  Bottom 0.61: SV30.4 21.41,74.07 21.46,74.12 SJ15.1
GAIN16  (via drill 0.35)
  Top 0.61: SV32.4 39.09,74.04 v39.09,73.99
  Bottom 0.61: SV32.4 39.52,74.04 40.21,74.73 SJ16.1
GAIN17  (via drill 0.35)
  Top 0.61: SV34.4 57.26,74.02 v57.26,73.98
  Bottom 0.61: SV34.4 58.06,74.02 58.32,74.27 SJ17.1
GAIN18  (via drill 0.35)
  Top 0.61: SV36.4 76.05,73.99 v76.05,73.94
  Bottom 0.61: SV36.4 76.5,73.99 77.04,74.52 SJ18.1
GAIN19  (via drill 0.35)
  Top 0.61: SV38.4 92.3,73.89 v93.93,73.89
  Bottom 0.61: SV38.4 94.49,73.94 95.07,74.52 SJ19.1
GAIN20  (via drill 0.35)
  Top 0.61: SV40.4 112.8,73.91 v112.8,73.87
  Bottom 0.61: SV40.4 113.21,73.91 113.92,74.62 SJ20.1
GAIN21  (via drill 0.35)
  Top 0.61: SV42.4 130.53,73.86 v130.53,73.81
  Bottom 0.61: SV42.4 130.99,73.86 131.88,74.75 SJ21.1
GAIN22  (via drill 0.35)
  Top 0.61: SV44.4 20.17,50.06 v20.17,50.03
  Bottom 0.61: SV44.4 20.7,50.06 21.21,50.57 SJ22.1
GAIN23  (via drill 0.35)
  Top 0.61: SV46.4 38.94,50.04 v38.94,50
  Bottom 0.61: SV46.4 39.32,50.04 39.98,50.7 SJ23.1
GAIN24  (via drill 0.35)
  Top 0.61: SV48.4 56.79,50.04 v56.79,50
  Bottom 0.61: SV48.4 57.3,50.04 58.01,50.75 SJ24.1
GAIN25  (via drill 0.35)
  Top 0.61: SV50.4 75.87,50.01 v75.87,49.98
  Bottom 0.61: SV50.4 76.66,50.01 76.78,50.14 SJ25.1
GAIN26  (via drill 0.35)
  Top 0.61: SV52.4 93.65,50.04 v93.65,50
  Bottom 0.61: SV52.4 94.41,50.04 94.77,50.39 SJ26.1
GAIN27  (via drill 0.35)
  Top 0.61: SV54.4 112.5,50.01 v112.5,49.98
  Bottom 0.61: SV54.4 113.16,50.01 113.66,50.52 SJ27.1
GAIN28  (via drill 0.35)
  Top 0.61: SV56.4 130.38,50.04 v130.38,50
  Bottom 0.61: SV56.4 130.81,50.04 131.65,50.88 SJ28.1
GND_ANA  (1 unrouted)
  Bottom 1.27: SV43.4 6.15,59.59 | 6.15,83.64 6.15,60.66 | 6.15,60.66 6.15,59.59 | 6.15,83.64 6.15,86.13 | 6.15,108.23 6.15,110.08 | 6.15,129.69 8.81,132.36 SV1.4 | SV15.4 10.77,108.23 6.15,108.23 | SV29.4 6.15,83.64 | SV45.4 27.33,59.56 26.97,59.92 | 26.97,131.39 26.97,137.36 26.87,137.47 | 26.97,131.39 26.97,119.02 | 26.97,119.02 26.97,108.36 | 26.97,108.36 26.97,94.74 | 26.97,94.74 26.97,83.59 | 26.97,83.59 26.97,69.75 | 26.97,69.75 26.97,59.92 | SV3.4 27.92,132.33 26.97,131.39 | SV17.4 26.97,108.36 | SV31.4 27,83.57 26.97,83.59 | SV47.4 45.16,59.56 | 45.16,108.36 45.16,94.82 | 45.16,94.82 45.16,83.59 | 45.16,69.95 45.16,83.54 SV33.4 | 45.16,69.95 45.16,59.56 | SV5.4 45.75,132.31 45.16,131.72 | SV19.4 45.16,108.36 | SV49.4 64.41,59.54 | 64.39,118.39 64.39,132.23 64.44,132.28 | 64.39,118.39 64.39,108.31 | 64.41,83.52 64.41,69.49 | 64.41,69.49 64.41,59.54 | SV7.4 64.44,132.28 | SV21.4 64.39,108.31 | SV35.4 64.41,83.52 | SV51.4 82.04,59.56 | 82.04,108.33 82.04,118.75 | 82.04,118.75 82.04,132.23 | 82.04,83.46 82.04,69.62 | 82.04,69.62 82.04,59.56 | SV9.4 82.04,132.23 | SV23.4 82.04,108.33 | SV37.4 82.04,83.46 | 100.25,108.31 100.25,118.19 | 100.25,118.19 100.25,131.57 | 100.25,108.31 100.25,93.75 | 100.25,93.75 100.25,83.44 | 100.25,83.44 100.25,69.72 | 100.25,69.72 100.25,59.54 | SV53.4 100.25,59.54 | SV11.4 100.89,132.21 100.25,131.57 | SV25.4 100.25,108.31 | SV39.4 100.25,83.44 | SV55.4 118.85,59.56 | 118.85,131.52 118.85,118.44 | 118.85,118.44 118.85,108.33 | SV13.4 119.48,132.16 118.85,131.52 | SV27.4 118.85,108.33 | SV41.4 118.85,83.39 | 6.15,59.59 6.15,47.04 15.98,37.21 | 58.22,18.64 34.54,18.64 15.98,37.21 | 58.22,18.64 59.64,20.06 X2.9 | 26.87,137.47 10.44,137.47 6.15,133.17 6.15,129.69
  Bottom 1.27: 26.87,137.47 45.16,137.47 | 45.16,137.47 64.41,137.47 | 64.41,137.47 82.04,137.47 | 82.04,137.47 100.25,137.47 | 100.25,137.47 115.37,137.47 118.85,133.99 118.85,131.52 | 100.25,131.57 100.25,137.47 | 45.16,131.72 45.16,118.54 | 45.16,118.54 45.16,108.36 | 45.16,131.72 45.16,137.47 | 64.41,83.52 64.39,83.54 64.39,94.44 | 64.39,94.44 64.39,108.31 | 64.44,132.28 64.41,132.31 64.41,137.47 | 82.04,132.23 82.04,137.47 | 82.04,83.46 82.04,94.54 | 82.04,94.54 82.04,108.33 | 118.85,108.33 118.85,93.07 | 118.85,93.07 118.85,83.39 | 118.85,83.39 118.85,70.13 | 118.85,70.13 118.85,59.56 | SV2.3 16.18,120.12 6.15,110.08 | SV16.3 15.98,95.96 6.15,86.13 | 6.15,110.08 6.15,129.69 | SV30.3 16.18,70.69 6.15,60.66 | SV44.3 15.98,37.21 | 26.97,59.92 26.97,48.72 28.88,46.81 33.3,46.81 34.92,48.44 SV46.3 | SV48.3 52.78,48.06 50.27,45.54 47.14,45.54 45.16,47.52 45.16,59.56 | 64.41,59.54 64.41,47.9 66.14,46.18 69.9,46.18 71.73,48.01 SV50.3 | 82.04,59.56 82.04,47.02 83.36,45.7 87.86,45.7 89.56,47.4 SV52.3 | 100.25,59.54 100.25,47.17 102.16,45.26 106.88,45.26 108.51,46.89 SV54.3 | 118.85,59.56 118.85,47.12 120.62,45.34 124.54,45.34 126.34,47.14 SV56.3 | SV42.3 126.54,72.01 124.66,70.13 118.85,70.13 | SV28.3 126.34,94.74 124.66,93.07 118.85,93.07 | SV14.3 126.54,120.04 124.94,118.44 118.85,118.44 | SV12.3 108.71,120.09 106.81,118.19 100.25,118.19 | SV26.3 108.51,95.55 106.7,93.75 100.25,93.75 | SV40.3 108.71,71.12 107.31,69.72 100.25,69.72 | SV10.3 89.76,120.19 88.32,118.75 82.04,118.75 | SV8.3 71.98,119.86 70.51,118.39 64.39,118.39 | SV22.3 71.73,96.57 69.6,94.44 64.39,94.44 | SV36.3 71.93,71.4 70.03,69.49 64.41,69.49
  Bottom 1.27: SV38.3 89.76,70.99 88.39,69.62 82.04,69.62 | SV24.3 89.56,96.37 87.73,94.54 82.04,94.54 | SV6.3 52.98,120.65 50.88,118.54 45.16,118.54 | SV4.3 35.13,120.34 33.81,119.02 26.97,119.02 | SV18.3 34.92,96.01 33.55,94.64 27.08,94.64 26.97,94.74 | SV32.3 35.13,71.6 33.27,69.75 26.97,69.75 | SV34.3 52.98,71.63 51.31,69.95 45.16,69.95 | SV20.3 52.78,96.29 51.31,94.82 45.16,94.82 | 58.22,18.64 60.33,18.64 | X2.11 61.64,19.96 60.33,18.64 | 60.33,18.64 62.33,18.64 | X2.13 63.64,19.95 62.33,18.64 | 62.33,18.64 64.39,18.64 65.64,19.89 X2.15 | 6.15,108.23 6.15,86.13
GND_DIG  (via drill 0.35)  (2 unrouted)
  Top 0.508: D1.C 7.49,114.43 D2.C D17.C D18.C D33.C D34.C 7.52,47.8 38.76,16.56 41.12,16.56 | D3.C D4.C 25.81,91.64 25.98,91.47 26.01,91.49 26.01,90.09 D20.C 25.91,68.48 D35.C D36.C 26.67,64.82 v26.67,41.38 | D5.C D6.C 44.15,92.28 D21.C D22.C 44.1,88.52 44.5,88.11 44.5,68.2 D37.C D38.C 44.75,64.95 44.75,44.7 49.53,39.93 49.53,29.9 | D7.C D8.C 62.66,92.28 D23.C D24.C 62.64,67.82 D39.C 62.66,65.61 D40.C 63.58,64.69 63.58,35.41 | D9.C D10.C 80.93,92.25 D25.C D26.C 80.98,88.52 81.48,88.01 81.48,68.35 D41.C D42.C 80.95,64.06 81.48,63.52 81.48,41.53 v81.51,41.5 | D11.C D12.C 99.47,92.46 D27.C D28.C 99.21,88.16 99.42,87.96 99.42,67.77 D43.C D44.C 100.33,64.26 100.33,30.38 v94.61,24.66 | D13.C D14.C 117.78,91.59 117.7,91.52 117.65,91.57 117.65,90.12 D30.C 117.76,88.62 118.14,88.24 118.14,68.2 D45.C D46.C 117.76,64.74 118.29,64.21 118.29,37.21 v105.64,24.56 | D15.C D16.C 136.35,92.25 D31.C D32.C 136.32,68.07 D47.C D48.C 136.3,64.69 137.16,63.83 137.16,42.11 99.89,4.84 96.32,4.84 | v26.67,33.58 v35.94,24.31 41.12,19.13 41.12,16.56 | 49.53,29.9 v49.53,24.56 | 63.58,35.41 v63.52,35.36 | v54.86,35.23 49.53,29.9 | v77.06,38.71 66.88,38.71 63.58,35.41 | 41.12,16.56 41.86,16.56 v41.94,16.48
  Top 0.813: X1.49 96.32,4.84
  Bottom 0.508: v26.67,41.38 v26.67,33.58 | v49.53,24.56 49.28,24.31 v35.94,24.31 | v63.52,35.36 54.99,35.36 v54.86,35.23 | v81.51,41.5 78.71,38.71 v77.06,38.71 | v94.61,24.66 94.64,24.64 94.64,13.69 | 94.64,8.15 94.64,13.56 | 94.64,13.69 94.64,13.56 | v105.64,24.56 94.64,13.56 | v41.94,16.48 91.85,16.48 94.64,13.69
  Bottom 0.813: X1.49 X1.50 94.64,6.89 94.64,8.15
VDD_ANA  (via drill 0.35)  (15 unrouted)
  Top 0.813: SV30.1 8.94,71.91 8.94,97 | 8.97,71.68 8.97,48.97 11,46.94 | 8.94,97 8.94,120.22 | 8.94,120.22 8.94,120.67 SV2.1 | SV16.1 9.07,97 8.94,97 | 8.94,120.22 27.46,120.22 | 29.97,122.73 27.46,120.22 | 27.46,120.22 45.34,120.22 | 45.34,120.22 47.83,122.71 | 45.34,120.22 64.36,120.22 | 64.36,120.22 64.54,120.4 | 64.54,120.4 66.83,122.68 | 64.36,120.22 82.19,120.22 | 82.19,120.22 82.47,120.5 | 82.47,120.5 84.61,122.63 | 82.19,120.22 101.17,120.22 | 101.17,120.22 101.3,120.34 | 101.3,120.34 103.56,122.61 | 101.17,120.22 119.05,120.22 119.28,120.45 | 119.28,120.45 121.39,122.55 | SV32.1 30.05,65.18 27.64,62.76 | 27.64,62.76 27.64,96.62 | SV18.1 27.64,96.62 | SV34.1 45.77,71.88 | 47.75,46.96 45.77,48.95 45.77,71.88 | SV20.1 45.77,96.88 45.77,71.88 | SV36.1 64.54,71.68 | 66.65,47.04 64.54,49.15 64.54,71.68 | SV22.1 64.54,96.67 | 64.54,96.67 64.54,71.68 | SV24.1 82.47,96.8 | 82.47,96.8 82.47,71.73 | 82.47,71.73 82.47,49.1 84.51,47.07 | SV38.1 82.47,71.73 | SV40.1 101.3,71.58 | 103.4,47.07 101.3,49.17 101.3,71.58 | SV26.1 101.3,96.67 | 101.3,96.67 101.3,71.58 | SV42.1 119.36,71.75 | 121.16,47.07 119.36,48.87 119.36,71.75 | SV28.1 119.36,96.9 | 119.36,96.9 119.36,71.75 | 27.64,96.62 27.64,120.04 27.46,120.22 | 64.54,96.67 64.54,120.4 | 82.47,96.8 82.47,120.5 | 101.3,96.67 101.3,120.34 | 119.36,96.9 119.28,96.98 119.28,120.45 | 27.64,62.76 27.64,49.73 29.85,47.52 29.85,47.12 | 10.9,47.04 10.9,46.94 v35.56,22.28
  Top 1.27: SV44.1 10.9,47.04 | 29.85,47.12 29.85,49.75 | 47.75,46.96 47.75,49.75 | 66.65,47.04 66.65,49.72 | 84.51,47.07 84.48,47.09 84.48,49.75 | 103.4,47.07 103.43,47.09 103.43,49.72 | 121.16,47.07 121.26,47.17 121.26,49.75
  Bottom 0.813: 48.95,22.25 51.63,22.25 X2.1 | 48.95,22.25 35.58,22.25 v35.56,22.28 | 48.95,22.25 50.42,20.78 52.73,20.78 | 52.73,20.78 54.71,20.78 55.64,21.71 X2.5 | 54.6,20.78 57.05,20.78 57.64,21.37 X2.7 | 52.73,20.78 53.64,21.68 X2.3
VLED1
  Top 0.305: D1.A 1.5,113.62 1.5,43.97 40.62,4.84 45.19,4.84
  Top 0.813: X1.1 45.19,4.84
VLED2
  Top 0.305: D2.A 1.96,111.84 1.96,44.2 39.31,6.84 45.06,6.84
  Top 0.813: X1.2 45.06,6.84
VLED3
  Top 0.254: 51.66,9.55 51.7,9.51 51.7,5.83
  Top 0.305: D3.A 22.81,116.11 21.9,115.2 21.9,113.55 23.82,111.63 23.82,95.57 21.09,92.84 21.09,88.79 23.67,86.21 23.67,72.91 19.41,68.64 19.41,63.63 23.44,59.59 23.44,38.96 51.66,10.74 51.66,9.55
  Top 0.813: X1.7 | X1.7 51.7,5.83
VLED4
  Top 0.254: 52.69,9.06 52.68,9.07
  Top 0.305: D4.A 24.28,112.9 24.28,95.38 21.55,92.65 21.55,88.98 24.15,86.37 24.15,72.75 19.86,68.46 19.86,63.82 23.9,59.78 23.9,39.29 52.68,10.52 52.68,9.6
  Top 0.813: X1.8 52.69,9.06 52.69,9.59 52.68,9.6
VLED5
  Top 0.254: 57.7,5.85 57.7,7.25 57.71,7.25 57.71,9.4
  Top 0.305: D5.A 40.11,115.6 40.11,113.28 42.21,111.18 42.21,95.72 39.12,92.62 39.12,88.8 42.21,85.7 42.21,72.98 38.23,69 38.23,63.96 41.76,60.43 41.76,40.17 43.64,38.29 | 43.64,38.29 43.64,38.28 | 43.64,38.29 45.69,36.23 45.69,21.97 57.71,9.96 57.71,9.4
  Top 0.813: X1.13 57.7,5.83 57.7,5.85
VLED6
  Top 0.305: D6.A 42.67,112.85 42.67,95.53 39.57,92.44 39.57,88.99 42.7,85.87 42.7,72.82 38.68,68.81 38.68,64.15 42.24,60.59 42.24,40.34 46.23,36.35 46.23,22.25 58.7,9.78 58.7,9.4
  Top 0.813: X1.14 58.67,6.86 58.67,9.37 58.7,9.4
VLED7
  Top 0.254: 60.33,40.4 60.33,34.77 52.65,27.1 52.65,20.83 63.7,9.78 63.7,5.93 63.83,5.8
  Top 0.305: D7.A 58.52,115.47 58.52,113.49 61.57,110.44 61.57,96.56 57.68,92.68 57.68,88.39 60.35,85.73 60.35,72.35 56.69,68.7 56.69,63.37 60.33,59.74 60.33,40.4
  Top 0.813: X1.19 63.83,5.69 63.83,5.8
VLED8
  Top 0.254: 60.78,40.64 60.78,34.04 54.65,27.91 54.65,21.83 54.66,21.83 54.66,19.94 64.72,9.88 64.72,9.07 | 64.72,8.66 64.69,8.63
  Top 0.305: D8.A 62.05,112.01 62.05,96.4 58.14,92.49 58.14,88.58 60.81,85.92 60.81,72.16 57.15,68.51 57.15,63.59 60.78,59.96 60.78,40.64
  Top 0.813: X1.20 64.69,8.63 64.69,9.04 64.72,9.07
VLED9
  Top 0.254: 78.44,40.99 78.44,38.56 64.64,24.77 64.64,15.85 69.67,10.82 69.67,8.65 69.7,8.62 69.7,5.95
  Top 0.305: D9.A 77.77,116.59 76.83,115.65 76.83,113.23 79.27,110.8 79.27,95.88 75.92,92.52 75.92,88.88 79.16,85.63 79.16,72.95 74.95,68.74 74.95,63.96 78.44,60.48 78.44,40.99
  Top 0.813: X1.25 69.7,5.83 69.7,5.95
VLED10
  Top 0.203: 70.69,9.12 70.69,11.58 66.62,15.65
  Top 0.254: 78.89,41.12 78.89,37.97 66.62,25.7 66.62,15.65
  Top 0.305: D10.A 79.78,112.55 79.78,95.74 76.38,92.33 76.38,89.07 79.69,85.76 79.69,72.83 75.41,68.55 75.41,64.15 78.89,60.67 78.89,41.12
  Top 0.813: X1.26 70.69,9.12
VLED11
  Top 0.254: 95.93,43.31 88.41,35.79 82.6,35.79 76.65,29.84 76.65,21.83 76.73,21.75 76.73,17.22 75.69,16.18 75.69,9.32 75.7,9.31 75.7,5.93
  Top 0.305: D11.A 96.22,116.61 95.33,115.72 95.33,112.75 97.79,110.29 97.79,96.61 94.21,93.03 94.21,88.65 97.31,85.55 97.31,72.68 93.32,68.7 93.32,63.53 97.28,59.57 97.28,44.66 95.93,43.31
  Top 0.813: X1.31 75.7,5.83 75.7,5.93
VLED12
  Top 0.254: 96.34,43.08 88.52,35.25 83.19,35.25 78.62,30.69 78.62,21.83 78.61,21.83 78.61,17.83 76.68,15.9 76.68,9.19 | 76.68,8.71 76.69,8.71
  Top 0.305: D12.A 98.27,112.6 98.27,96.44 94.67,92.84 94.67,88.84 97.77,85.74 97.77,72.5 93.78,68.51 93.78,63.72 97.74,59.76 97.74,44.47 96.34,43.08
  Top 0.813: X1.32 76.69,8.71 76.69,9.19 76.68,9.19
VLED13
  Top 0.254: 81.69,9.19 81.7,9.18 81.7,5.98
  Top 0.305: D13.A 113.61,115.42 113.61,113.39 116.38,110.62 116.38,96.63 112.52,92.77 112.52,88.83 115.93,85.42 115.93,73.03 111.71,68.82 111.71,63.78 115.37,60.13 115.37,43.44 81.69,9.76 81.69,9.19
  Top 0.813: X1.37 81.7,5.83 81.7,5.98
VLED14
  Top 0.305: D14.A 116.89,112.27 116.89,96.49 112.98,92.58 112.98,89.02 116.38,85.61 116.38,72.84 112.17,68.63 112.17,63.97 115.82,60.32 115.82,42.97 82.68,9.83 82.68,8.99
  Top 0.813: X1.38 82.69,8.45 82.68,8.46 82.68,8.99
VLED15  (1 unrouted)
  Top 0.254: 87.71,6.05 87.7,6.05 87.7,8.81 87.66,8.86
  Top 0.305: D15.A 132.11,115.34 132.11,113.23 134.21,111.13 134.21,96.43 131.29,93.51 131.29,88.7 134.16,85.83 134.16,72.98 130.28,69.1 130.28,63.88 133.85,60.31 133.85,44.98 101.46,12.6 90.3,12.6 87.66,9.96 87.66,8.86
  Top 0.813: X1.43 87.71,5.82 87.71,6.03 87.7,6.04
VLED16
  Top 0.305: D16.A 134.67,113.03 134.67,96.24 131.75,93.32 131.75,88.89 134.64,86 134.64,72.81 130.73,68.91 130.73,64.07 134.31,60.49 134.31,44.58 101.65,11.91 90.6,11.91 88.65,9.96 88.65,9.02
  Top 0.813: X1.44 88.69,8.44 88.65,8.48 88.65,9.02
VLED17
  Top 0.254: 47.94,5.59 47.7,5.83 47.7,9.55 47.73,9.58
  Top 0.305: D17.A 2.44,90.12 2.44,44.4 35.99,10.85 46.74,10.85 47.73,9.86 47.73,9.58
  Top 0.813: X1.3 | X1.3 47.94,5.59
VLED18
  Top 0.254: 48.69,9.12 48.69,9.11
  Top 0.305: D18.A 2.92,88.37 2.92,44.63 36.09,11.45 47.45,11.45 48.69,10.21 48.69,9.58
  Top 0.813: X1.4 48.69,9.11 48.69,9.57 48.69,9.58
VLED19
  Top 0.254: X1.9 54.69,4.87 53.7,5.85 53.7,9.54 53.7,9.55
  Top 0.305: D19.A 22.86,91.67 22,90.82 22,89.17 24.66,86.51 24.66,72.61 20.32,68.27 20.32,64.01 24.41,59.92 24.41,39.61 53.7,10.33 53.7,9.55
VLED20
  Top 0.254: 54.69,8.96 54.69,8.97
  Top 0.305: D20.A 25.14,87.76 25.14,72.44 20.78,68.08 20.78,64.2 24.89,60.09 24.89,39.88 54.69,10.08 54.69,9.45
  Top 0.813: X1.10 54.69,8.96 54.69,9.45
VLED21
  Top 0.254: 59.85,5.73 59.7,5.88 59.7,7.25 59.72,7.26 59.72,9.42
  Top 0.305: D21.A 40.03,91.16 40.03,89.18 43.23,85.98 43.23,72.7 39.14,68.62 39.14,64.34 42.7,60.78 42.7,40.54 46.76,36.47 46.76,22.53 59.72,9.58 59.72,9.42
  Top 0.813: X1.15 59.85,5.68 59.85,5.73
VLED22
  Top 0.254: 60.68,8.86 60.69,8.86
  Top 0.305: D22.A 43.79,87.33 43.79,72.62 39.6,68.43 39.6,64.53 43.16,60.97 43.16,40.73 43.88,40 | 43.88,40 43.89,40 | 43.88,40 47.32,36.56 47.32,22.73 60.58,9.47 60.58,9.27
  Top 0.813: X1.16 60.69,8.86 60.69,8.92 | 60.69,8.92 | 60.69,8.92 60.69,9.16 60.58,9.27
VLED23
  Top 0.254: 61.27,40.8 61.27,32.62 56.62,27.97 56.62,18.89 65.71,9.8 65.71,7.25 65.7,7.25 65.7,6 65.89,5.82
  Top 0.305: D23.A 58.6,91.21 58.6,88.77 61.29,86.08 61.29,71.97 57.61,68.29 57.61,63.78 61.27,60.12 61.27,40.8
  Top 0.813: X1.21 65.89,5.64 65.89,5.82
VLED24
  Top 0.254: 61.75,41.12 61.75,31.32 58.65,28.22 58.65,17.98 66.7,9.93 66.7,9.19 | 66.67,8.71 66.69,8.7
  Top 0.305: D24.A 61.8,87.88 61.8,71.81 58.06,68.08 58.06,63.97 61.75,60.29 61.75,41.12
  Top 0.813: X1.22 66.69,8.7 66.7,8.71 66.7,9.19
VLED25
  Top 0.203: 68.66,14.94 71.68,11.91 71.68,9.04
  Top 0.254: 79.4,41.42 79.4,37.66 68.65,26.92 68.65,21.83 68.66,21.83 68.66,14.94 | 71.68,5.85 71.68,9.04
  Top 0.305: D25.A 76.83,91.06 76.83,89.26 80.16,85.93 80.16,72.66 75.87,68.36 75.87,64.34 79.4,60.81 79.4,41.42
  Top 0.813: X1.27 71.68,5.85
VLED26
  Top 0.203: 70.66,14.68 72.67,12.67 72.67,9.02
  Top 0.254: 79.9,41.87 79.9,37.12 70.65,27.88 70.65,21.83 70.66,21.83 70.66,14.68
  Top 0.305: D26.A 80.62,87.38 80.62,72.47 76.33,68.17 76.33,64.53 79.9,60.96 79.9,41.87
  Top 0.813: X1.28 72.69,8.63 | 72.69,8.63 72.69,8.64 | 72.69,8.63 72.69,9 72.67,9.02
VLED27
  Top 0.254: 96.76,42.84 88.59,34.67 83.77,34.67 80.64,31.55 80.64,18.44 77.75,15.55 77.75,9.19 77.7,9.14 77.7,5.87
  Top 0.305: D27.A 95.12,91.11 95.12,89.03 98.22,85.93 98.22,72.3 94.23,68.32 94.23,63.91 98.2,59.95 98.2,44.28 96.76,42.84
  Top 0.813: X1.33 77.7,5.83 77.7,5.87
VLED28
  Top 0.254: 97.09,42.53 88.55,33.98 84.89,33.98 82.63,31.72 82.63,18.59 78.66,14.63 78.66,9.19 | 78.69,8.64 78.69,8.63
  Top 0.305: D28.A 96.21,89.28 98.68,86.82 98.68,72.12 94.69,68.13 94.69,64.1 98.68,60.11 98.68,44.12 97.09,42.53
  Top 0.813: X1.34 78.69,8.63 78.66,8.66 78.66,9.19
VLED29
  Top 0.254: 83.67,8.94 83.69,8.91 83.69,5.84
  Top 0.305: D29.A 114.61,92.23 113.44,91.06 113.44,89.2 116.89,85.75 116.89,72.71 112.62,68.44 112.62,64.16 116.28,60.5 116.28,42.38 83.67,9.76 83.67,8.94
  Top 0.813: X1.39 83.69,5.84
VLED30
  Top 0.305: D30.A 117.35,87.42 117.35,72.52 113.08,68.25 113.08,64.35 116.74,60.69 116.74,41.93 84.68,9.88 84.68,8.94
  Top 0.813: X1.40 84.69,8.5 84.68,8.51 84.68,8.94
VLED31
  Top 0.254: 89.69,6.05 89.69,9.78
  Top 0.305: D31.A 132.21,91.11 132.21,89.08 135.15,86.13 135.15,72.68 131.19,68.72 131.19,64.26 134.77,60.68 134.77,44.18 101.89,11.3 91.21,11.3 89.69,9.78
  Top 0.813: X1.45 89.69,5.84 89.69,6.05
VLED32
  Top 0.305: D32.A 135.61,87.76 135.61,72.49 131.65,68.53 131.65,64.45 135.23,60.87 135.23,43.79 102.03,10.59 91.62,10.59 90.65,9.63 90.65,8.97
  Top 0.813: X1.46 90.69,8.93 90.65,8.97
VLED33
  Top 0.254: 49.7,5.83 49.7,7.25 49.71,7.25 49.71,9.52 49.68,9.55
  Top 0.305: D33.A 4.52,67.8 3.41,66.69 3.41,44.87 36.17,12.12 47.95,12.12 49.68,10.39 49.68,9.55
  Top 0.813: X1.5 | X1.5 49.7,5.83
VLED34
  Top 0.254: 50.69,9.06 50.7,9.07
  Top 0.305: D34.A 3.99,65.35 3.99,45.01 36.25,12.75 48.41,12.75 50.67,10.49 50.67,9.5
  Top 0.813: X1.6 50.69,9.06 50.69,9.48 50.67,9.5
VLED35
  Top 0.254: 55.7,9.47 55.7,5.85
  Top 0.305: D35.A 21.23,66.8 21.23,64.39 25.36,60.27 25.36,40.43 55.7,10.08 55.7,9.47
  Top 0.813: X1.11 55.7,5.83 55.7,5.85
VLED36
  Top 0.254: 56.69,8.91
  Top 0.305: D36.A 25.83,62.66 25.83,40.97 56.69,10.11 56.69,9.45
  Top 0.813: X1.12 56.69,8.91 56.69,9.44 56.69,9.45
VLED37
  Top 0.254: 61.93,5.72 61.7,5.95 61.7,9.26
  Top 0.305: D37.A 40.06,66.75 40.06,64.72 43.61,61.16 43.61,40.92 44.07,40.46 44.08,40.46 47.88,36.66 47.88,23.09 61.7,9.26
  Top 0.813: X1.17 61.93,5.6 61.93,5.72
VLED38
  Top 0.254: 62.69,8.74
  Top 0.305: D38.A 44.07,62.63 44.07,41.3 48.54,36.83 48.54,23.32 62.59,9.27
  Top 0.813: X1.18 62.69,8.74 62.69,9.17 62.59,9.27
VLED39
  Top 0.254: 62.2,41.5 62.2,30 60.65,28.45 60.65,17.27 67.69,10.24 67.69,8.66 67.7,8.65 67.7,5.95 67.75,5.9
  Top 0.305: D39.A 58.52,66.65 58.52,64.16 62.2,60.48 62.2,41.5
  Top 0.813: X1.23 67.75,5.78 67.75,5.9
VLED40
  Top 0.254: 62.69,41.86 62.69,28.8 62.65,28.77 62.65,16.16 68.73,10.08 68.73,9.27
  Top 0.305: D40.A 62.69,62.58 62.69,41.86
  Top 0.813: X1.24 68.68,6.85 68.68,9.22 68.73,9.27
VLED41
  Top 0.203: 72.64,16.1 72.64,14.71 73.69,13.66 73.69,9.07
  Top 0.254: 80.37,42.09 80.37,36.76 72.64,29.03 72.64,16.1 72.64,16.08 | 73.69,8.64 73.7,8.62 | 73.7,5.88 73.7,8.62 | 73.7,8.62 73.7,9.05 73.69,9.07
  Top 0.305: D41.A 76.78,66.65 76.78,64.72 80.37,61.13 80.37,42.09
  Top 0.813: X1.29 73.7,5.83 73.7,5.88
VLED42
  Top 0.254: 80.85,42.24 80.85,36.09 74.65,29.9 74.65,9.27
  Top 0.305: D42.A 80.85,62.74 80.85,42.24
  Top 0.813: X1.30 74.68,6.85 74.68,9.25 74.65,9.27
VLED43  (1 unrouted)
  Top 0.254: 97.16,41.95 88.63,33.43 85.75,33.43 84.63,32.31 84.63,19.1 79.7,14.17 79.7,8.56 | 79.7,8.56 | 79.72,6.04 79.7,6.05 79.7,8.56
  Top 0.305: D43.A 95.15,66.5 95.15,64.29 99.14,60.3 99.14,43.93 97.16,41.95
  Top 0.813: X1.35 79.72,5.81 79.72,6.02 79.72,6.03
VLED44
  Top 0.254: 97.41,41.55 88.62,32.77 87.05,32.77 86.64,32.36 86.64,19.69 80.7,13.74 80.7,9.12 | 80.67,8.56 80.69,8.54
  Top 0.305: D44.A 99.59,62 99.59,43.74 97.41,41.55
  Top 0.813: X1.36 80.69,8.54 80.7,8.55 80.7,9.12
VLED45
  Top 0.254: 85.7,5.84 85.7,8.97
  Top 0.305: D45.A 113.54,66.6 113.54,64.54 117.22,60.86 117.22,41.59 85.7,10.07 85.7,8.97
  Top 0.813: X1.41 85.7,5.83 85.7,5.84
VLED46
  Top 0.305: D46.A 117.73,62.66 117.73,41.15 86.69,10.11 86.69,8.94
  Top 0.813: X1.42 86.69,8.21 | 86.69,8.21 86.69,8.2 | 86.69,8.21 86.69,8.94
VLED47
  Top 0.254: 91.69,8.46 91.7,8.45 91.7,5.85
  Top 0.305: D47.A 132.11,66.85 132.11,64.64 135.69,61.06 135.69,43.42 102.22,9.96 92.56,9.96 91.69,9.09 91.69,8.46
  Top 0.813: X1.47 91.7,5.83 91.7,5.85
VLED48
  Top 0.305: D48.A 136.14,62.99 136.14,43.05 102.54,9.45 93.27,9.45 92.69,8.87
  Top 0.813: X1.48 92.69,8.87

### Text on the board
tNames: JOSHUA BREWSTER (MIT LICENSE) | DIY DIFFUSE OPTICAL TOMOGRAPHY | The Dream Machine / The "2Kool4Skool" / The "End of Privacy"
tValues: A1 | A2 | A3 | A4 | A5 | A6 | A7 | A9 | A10 | A11 | A12 | A13 | A14 | A8 | A17 | A15 | A16 | A18 | A19 | A20 | A21 | A22 | A23 | A24 | A26 | A27 | A28 | A25 | 22 | 15 | 8 | 1 | 23 | 16 | 9 | 2 | 17 | 3 | 18 | 4 | 19 | 5 | 20 | 6 | 21 | 7 | NC | NC | SENSORS | G_A | G_A | G_A | G_A | V_A | V_A | V_A | V_A | 24 | 10 | 25 | 11 | 26 | 12 | 27 | 13 | 28 | 14 | NC | NC | SENSORS | SENSORS | LEDs | 2 | 18 | 22 | 28 | 44 | 14 | 30 | 46 | 16 | 32 | 48 | G_D | 34 | 4 | 20 | 36 | 6 | 38 | 8 | 24 | 40 | 10 | 26 | 42 | 12 | 3 | 19 | 35 | 5 | 21 | 37 | 7 | 23 | 39 | 9 | 25 | 41 | 11 | 27 | 43 | 13 | 29 | 45 | 15 | 31 | 47 | G_D | 1 | 17 | 33 | LEDs
tDocu: BASED ON pnas.org/content/104/29/12169 | 28 optical channels, 24 LED pairs | Use OPT101 (the cheap aliexpress ones) / and 1206 spec LEDs